# EAGLE design CoCoFlash_v1.04c (EAGLE 7.7.0)

## Sheet 1 of 5
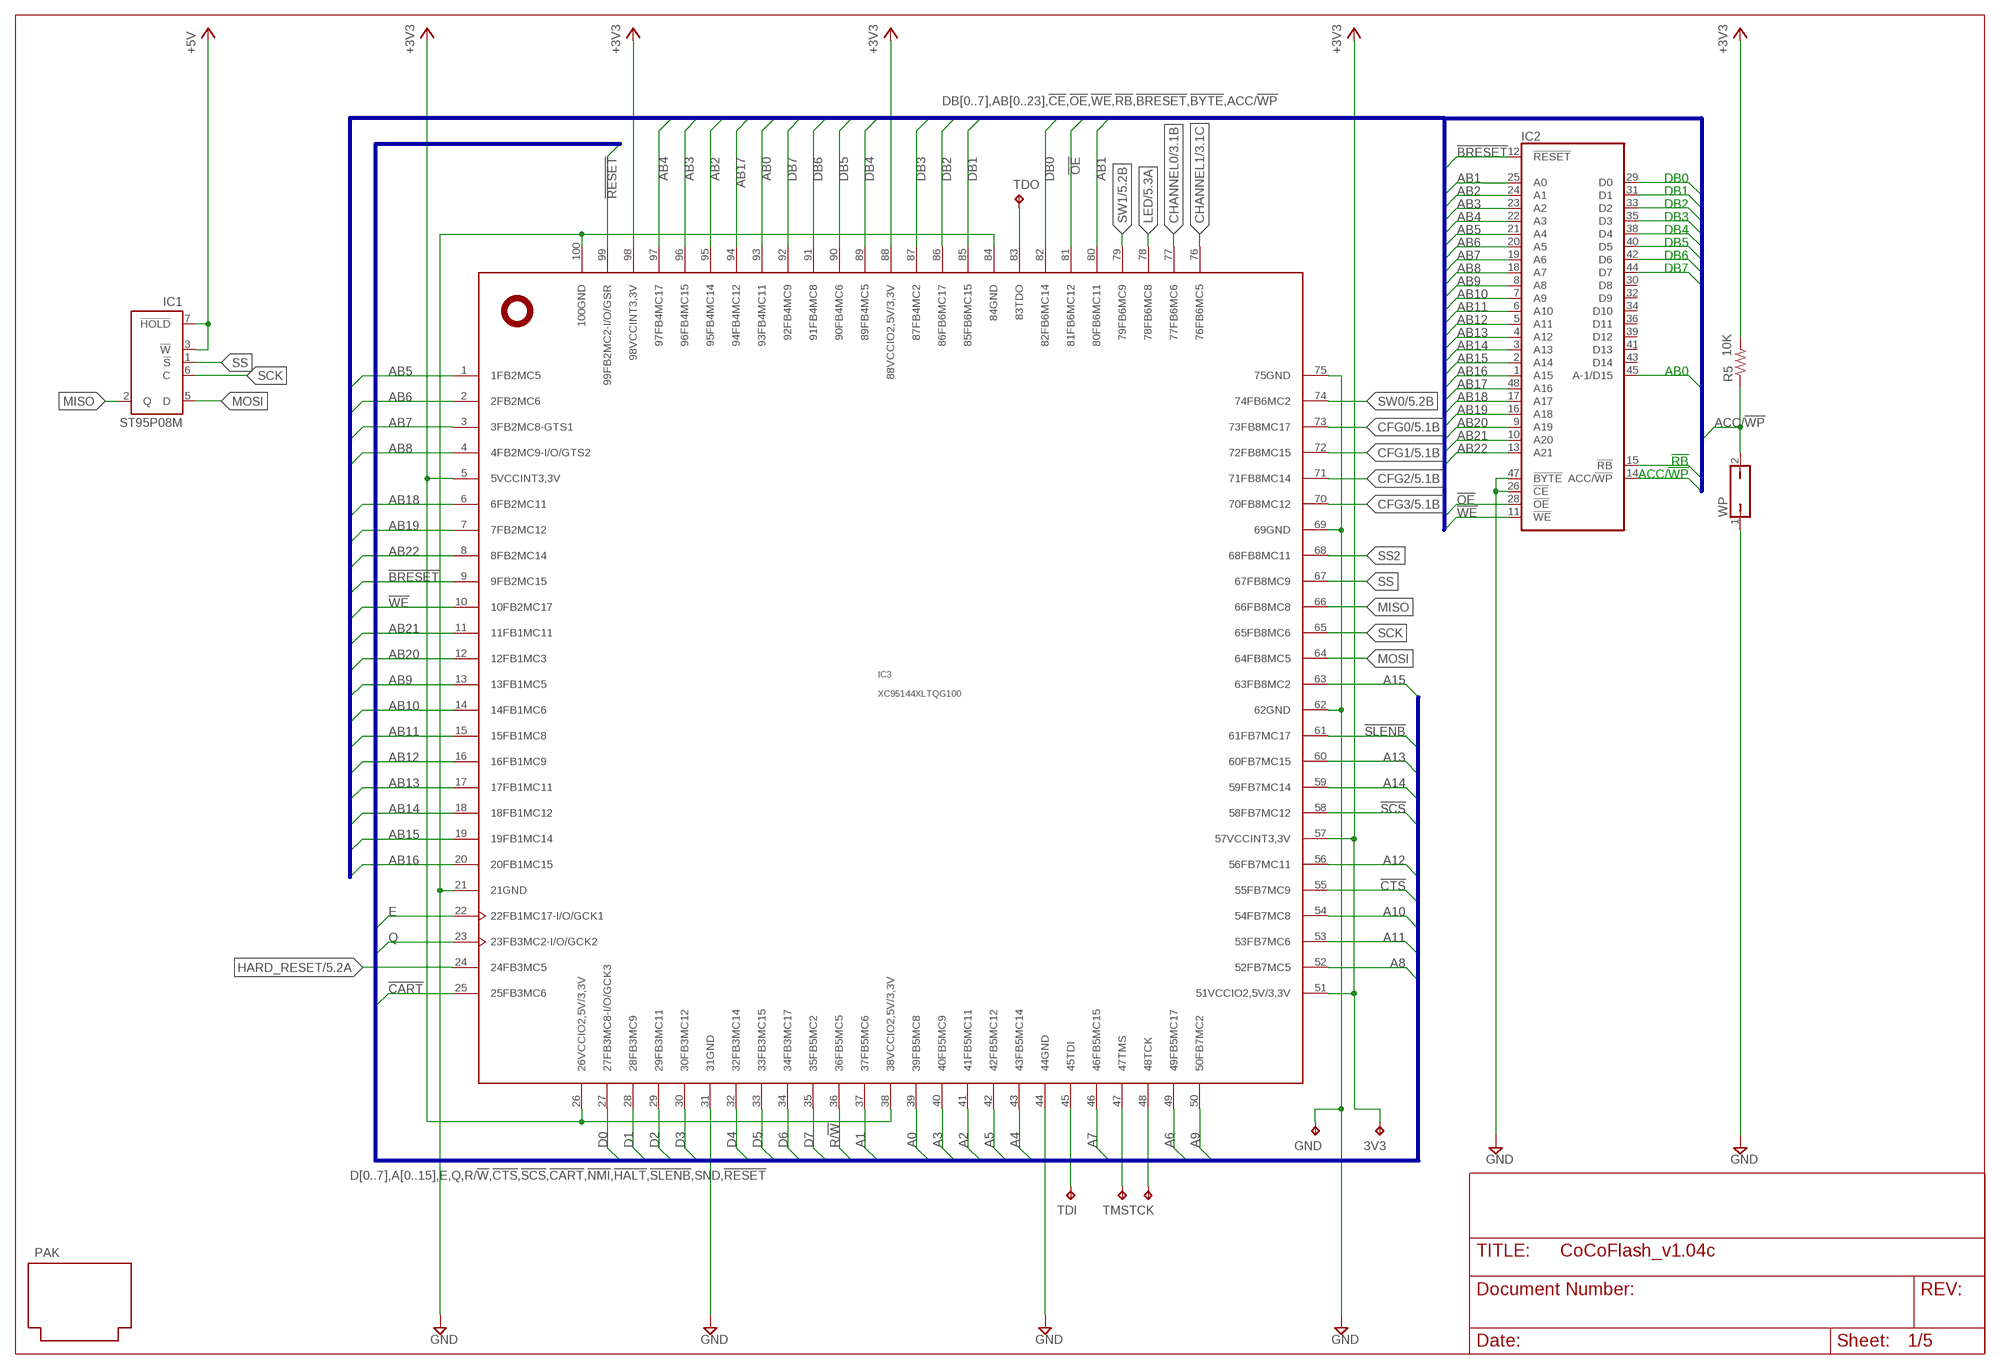
[diagram p0: schematic, sheet 1]

### Parts
3V3  TPTP08R  [TP08R]
GND  TPTP08R  [TP08R]
IC1  ST95P08M  [SO08]
IC2  MX29LV640  [TSOP48]
IC3  XC95144XLTQG100  [TQFP100]
PAK  PROGRAM_PAK  [PROGRAM_PAK]
R5  10K  R-US_R0402  [R0402]
TCK  TPTP08R  [TP08R]
TDI  TPTP08R  [TP08R]
TDO  TPTP08R  [TP08R]
TMS  TPTP08R  [TP08R]
WP  JP1Q  [JP1]

### Nets
!BRESET: IC2.12(!RESET) IC3.9(9FB2MC15)
!CART: IC3.25(25FB3MC6) ; also sheet 2
!CTS: IC3.55(55FB7MC9) ; also sheet 2
!OE: IC2.28(!OE) IC3.81(81FB6MC12)
!RB: IC2.15(!RB)
!RESET: IC3.99(99FB2MC2-I/O/GSR) ; also sheet 2,5
!SCS: IC3.58(58FB7MC12) ; also sheet 2
!SLENB: IC3.61(61FB7MC17) ; also sheet 2
!WE: IC2.11(!WE) IC3.10(10FB2MC17)
+3V3: 3V3.TP IC3.5(5VCCINT3,3V) IC3.26(26VCCIO2,5V/3,3V) IC3.38(38VCCIO2,5V/3,3V) IC3.51(51VCCIO2,5V/3,3V) IC3.57(57VCCINT3,3V) IC3.88(88VCCIO2,5V/3,3V) IC3.98(98VCCINT3,3V) R5.2 ; also sheet 4,5
+5V: IC1.3(!W) IC1.7(!HOLD) ; also sheet 2,3,4,5
A0: IC3.39(39FB5MC8) ; also sheet 2
A1: IC3.37(37FB5MC6) ; also sheet 2
A2: IC3.41(41FB5MC11) ; also sheet 2
A3: IC3.40(40FB5MC9) ; also sheet 2
A4: IC3.43(43FB5MC14) ; also sheet 2
A5: IC3.42(42FB5MC12) ; also sheet 2
A6: IC3.49(49FB5MC17) ; also sheet 2
A7: IC3.46(46FB5MC15) ; also sheet 2
A8: IC3.52(52FB7MC5) ; also sheet 2
A9: IC3.50(50FB7MC2) ; also sheet 2
A10: IC3.54(54FB7MC8) ; also sheet 2
A11: IC3.53(53FB7MC6) ; also sheet 2
A12: IC3.56(56FB7MC11) ; also sheet 2
A13: IC3.60(60FB7MC15) ; also sheet 2
A14: IC3.59(59FB7MC14) ; also sheet 2
A15: IC3.63(63FB8MC2) ; also sheet 2
AB0: IC2.45(A-1/D15) IC3.93(93FB4MC11)
AB1: IC2.25(A0) IC3.80(80FB6MC11)
AB2: IC2.24(A1) IC3.95(95FB4MC14)
AB3: IC2.23(A2) IC3.96(96FB4MC15)
AB4: IC2.22(A3) IC3.97(97FB4MC17)
AB5: IC2.21(A4) IC3.1(1FB2MC5)
AB6: IC2.20(A5) IC3.2(2FB2MC6)
AB7: IC2.19(A6) IC3.3(3FB2MC8-GTS1)
AB8: IC2.18(A7) IC3.4(4FB2MC9-I/O/GTS2)
AB9: IC2.8(A8) IC3.13(13FB1MC5)
AB10: IC2.7(A9) IC3.14(14FB1MC6)
AB11: IC2.6(A10) IC3.15(15FB1MC8)
AB12: IC2.5(A11) IC3.16(16FB1MC9)
AB13: IC2.4(A12) IC3.17(17FB1MC11)
AB14: IC2.3(A13) IC3.18(18FB1MC12)
AB15: IC2.2(A14) IC3.19(19FB1MC14)
AB16: IC2.1(A15) IC3.20(20FB1MC15)
AB17: IC2.48(A16) IC3.94(94FB4MC12)
AB18: IC2.17(A17) IC3.6(6FB2MC11)
AB19: IC2.16(A18) IC3.7(7FB2MC12)
AB20: IC2.9(A19) IC3.12(12FB1MC3)
AB21: IC2.10(A20) IC3.11(11FB1MC11)
AB22: IC2.13(A21) IC3.8(8FB2MC14)
ACC/!WP: IC2.14(ACC/!WP) R5.1 WP.2
CFG0: IC3.73(73FB8MC17) ; also sheet 5
CFG1: IC3.72(72FB8MC15) ; also sheet 5
CFG2: IC3.71(71FB8MC14) ; also sheet 5
CFG3: IC3.70(70FB8MC12) ; also sheet 5
CHANNEL0: IC3.77(77FB6MC6) ; also sheet 3
CHANNEL1: IC3.76(76FB6MC5) ; also sheet 3
D0: IC3.27(27FB3MC8-I/O/GCK3) ; also sheet 2,3
D1: IC3.28(28FB3MC9) ; also sheet 2,3
D2: IC3.29(29FB3MC11) ; also sheet 2,3
D3: IC3.30(30FB3MC12) ; also sheet 2,3
D4: IC3.32(32FB3MC14) ; also sheet 2,3
D5: IC3.33(33FB3MC15) ; also sheet 2,3
D6: IC3.34(34FB3MC17) ; also sheet 2,3
D7: IC3.35(35FB5MC2) ; also sheet 2,3
DB0: IC2.29(D0) IC3.82(82FB6MC14)
DB1: IC2.31(D1) IC3.85(85FB6MC15)
DB2: IC2.33(D2) IC3.86(86FB6MC17)
DB3: IC2.35(D3) IC3.87(87FB4MC2)
DB4: IC2.38(D4) IC3.89(89FB4MC5)
DB5: IC2.40(D5) IC3.90(90FB4MC6)
DB6: IC2.42(D6) IC3.91(91FB4MC8)
DB7: IC2.44(D7) IC3.92(92FB4MC9)
E: IC3.22(22FB1MC17-I/O/GCK1) ; also sheet 2
GND: GND.TP IC2.26(!CE) IC2.47(!BYTE) IC3.21(21GND) IC3.31(31GND) IC3.44(44GND) IC3.62(62GND) IC3.69(69GND) IC3.75(75GND) IC3.84(84GND) IC3.100(100GND) WP.1 ; also sheet 2,3,4,5
HARD_RESET: IC3.24(24FB3MC5) ; also sheet 5
LED: IC3.78(78FB6MC8) ; also sheet 5
MISO: IC1.2(Q) IC3.66(66FB8MC8)
MOSI: IC1.5(D) IC3.64(64FB8MC5)
N$5: IC3.45(45TDI) TDI.TP
N$6: IC3.47(47TMS) TMS.TP
N$7: IC3.48(48TCK) TCK.TP
N$8: IC3.83(83TDO) TDO.TP
Q: IC3.23(23FB3MC2-I/O/GCK2) ; also sheet 2
R/!W: IC3.36(36FB5MC5) ; also sheet 2
SCK: IC1.6(C) IC3.65(65FB8MC6)
SS: IC1.1(!S) IC3.67(67FB8MC9)
SS2: IC3.68(68FB8MC11)
SW0: IC3.74(74FB6MC2) ; also sheet 5
SW1: IC3.79(79FB6MC9) ; also sheet 5
Unconnected: IC2.30(D8) IC2.32(D9) IC2.34(D10) IC2.36(D11) IC2.39(D12) IC2.41(D13) IC2.43(D14)

### Buses
D[0..7],A[0..15],E,Q,R/!W,!CTS,!SCS,!CART,!NMI,!HALT,!SLENB,SND,!RESET
DB[0..7],AB[0..23],!CE,!OE,!WE,!RB,!BRESET,!BYTE,ACC/!WP

## Sheet 2 of 5
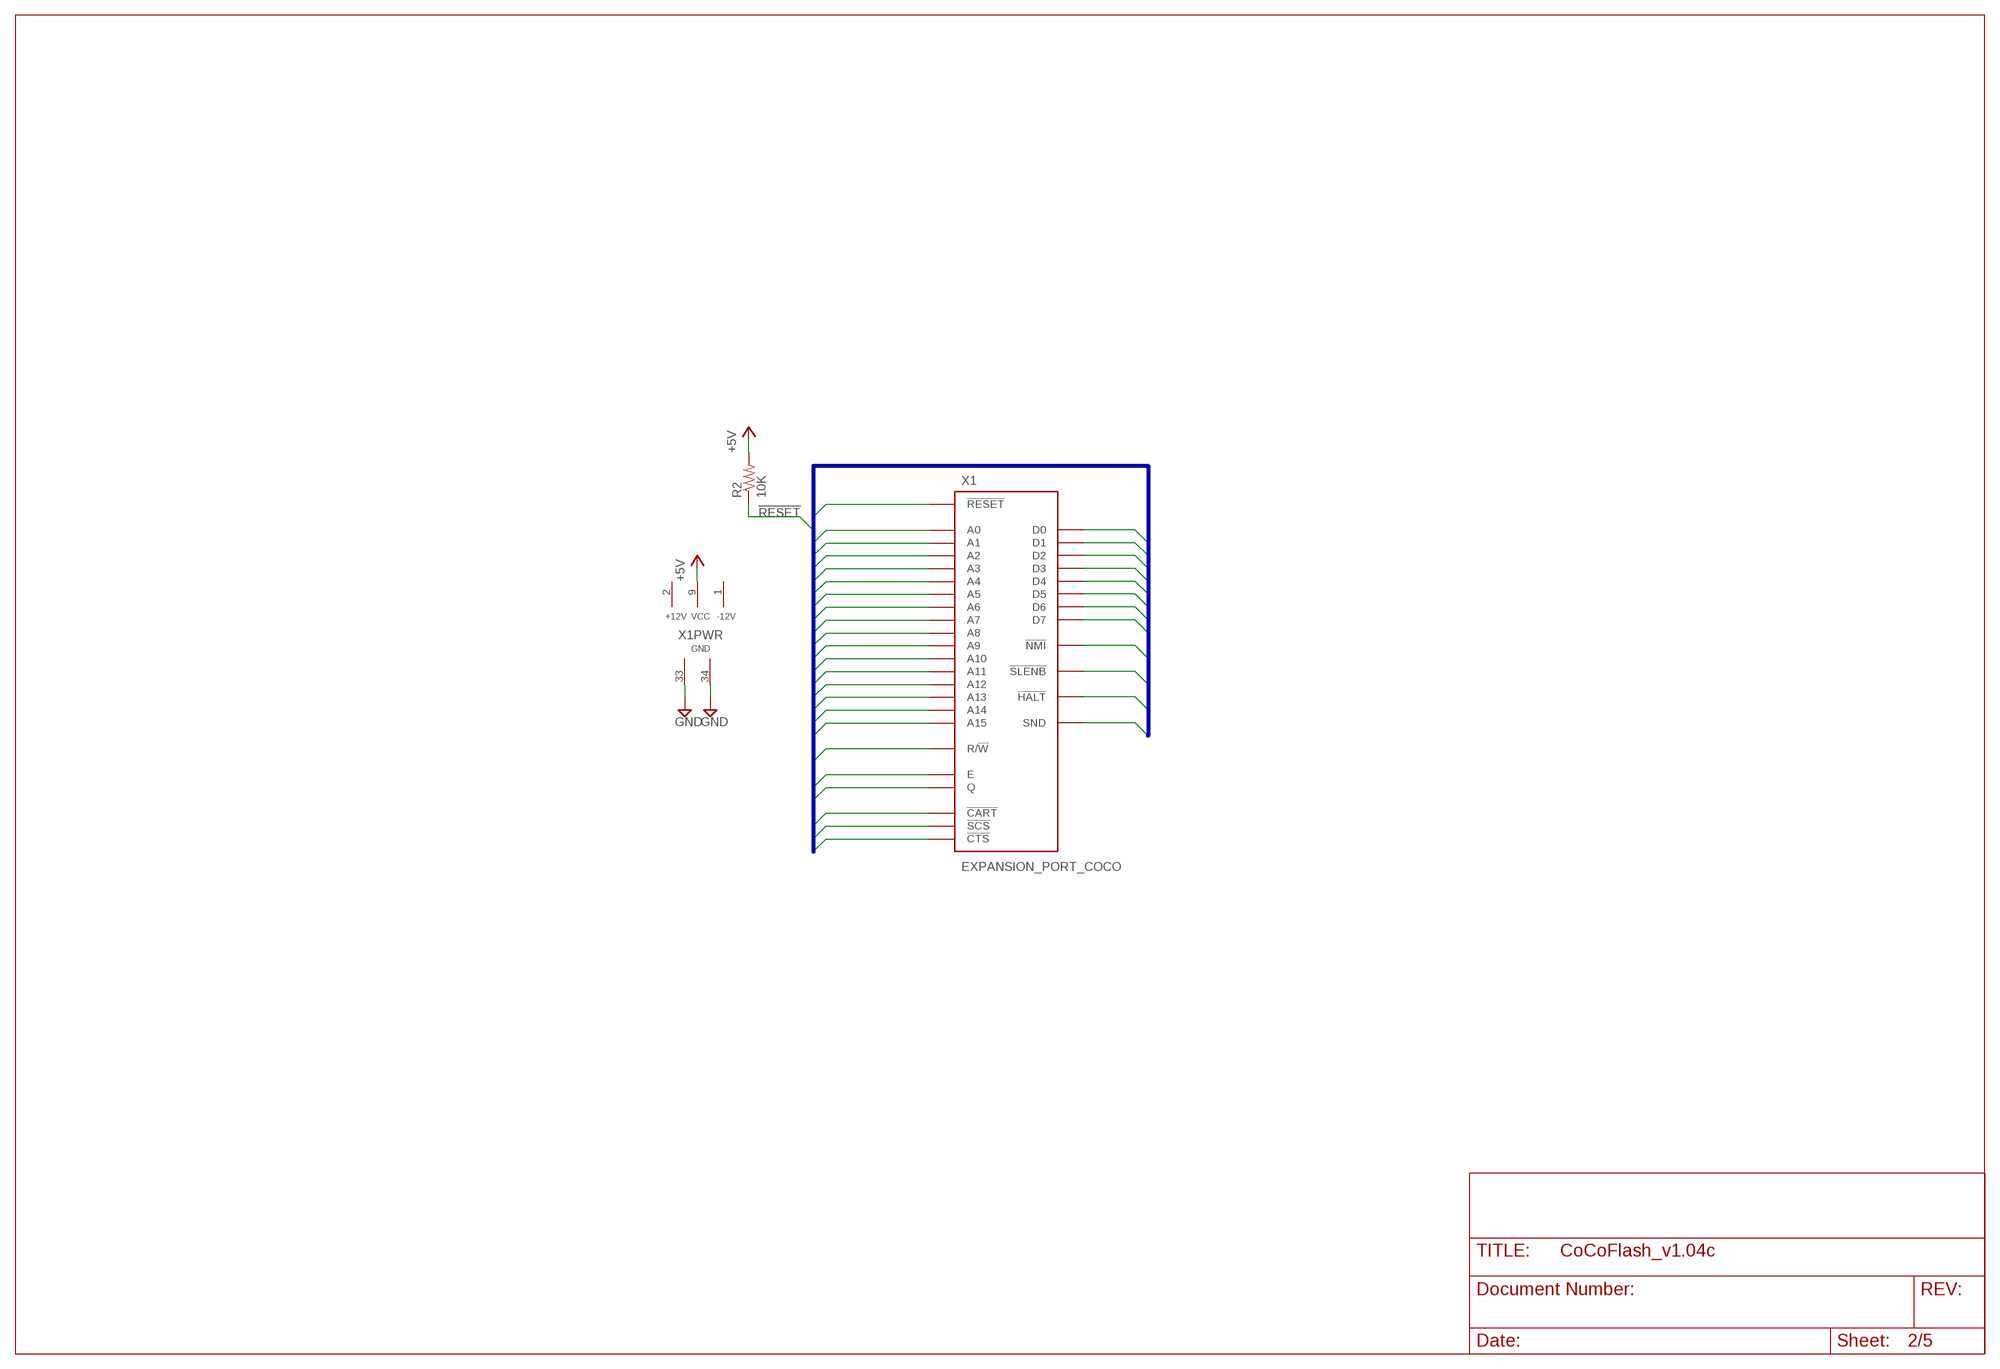
[diagram p1: schematic, sheet 2]

### Parts
R2  10K  R-US_R0402  [R0402]
X1  EXPANSION_PORT_COCO  [MA20-2]

### Nets
!CART: X1.8(!CART) ; also sheet 1
!CTS: X1.32(!CTS) ; also sheet 1
!HALT: X1.3(!HALT)
!NMI: X1.4(!NMI)
!RESET: R2.1 X1.5(!RESET) ; also sheet 1,5
!SCS: X1.36(!SCS) ; also sheet 1
!SLENB: X1.40(!SLENB) ; also sheet 1
+5V: R2.2 X1.9(VCC) ; also sheet 1,3,4,5
A0: X1.19(A0) ; also sheet 1
A1: X1.20(A1) ; also sheet 1
A2: X1.21(A2) ; also sheet 1
A3: X1.22(A3) ; also sheet 1
A4: X1.23(A4) ; also sheet 1
A5: X1.24(A5) ; also sheet 1
A6: X1.25(A6) ; also sheet 1
A7: X1.26(A7) ; also sheet 1
A8: X1.27(A8) ; also sheet 1
A9: X1.28(A9) ; also sheet 1
A10: X1.29(A10) ; also sheet 1
A11: X1.30(A11) ; also sheet 1
A12: X1.31(A12) ; also sheet 1
A13: X1.37(A13) ; also sheet 1
A14: X1.38(A14) ; also sheet 1
A15: X1.39(A15) ; also sheet 1
D0: X1.10(D0) ; also sheet 1,3
D1: X1.11(D1) ; also sheet 1,3
D2: X1.12(D2) ; also sheet 1,3
D3: X1.13(D3) ; also sheet 1,3
D4: X1.14(D4) ; also sheet 1,3
D5: X1.15(D5) ; also sheet 1,3
D6: X1.16(D6) ; also sheet 1,3
D7: X1.17(D7) ; also sheet 1,3
E: X1.6(E) ; also sheet 1
GND: X1.33(GND) X1.34(GND) ; also sheet 1,3,4,5
Q: X1.7(Q) ; also sheet 1
R/!W: X1.18(R/!W) ; also sheet 1
SND: X1.35(SND) ; also sheet 3

### Buses
D[0..7],A[0..15],E,Q,R/!W,!CTS,!SCS,!CART,!NMI,!HALT,!SLENB,SND,!RESET

## Sheet 3 of 5
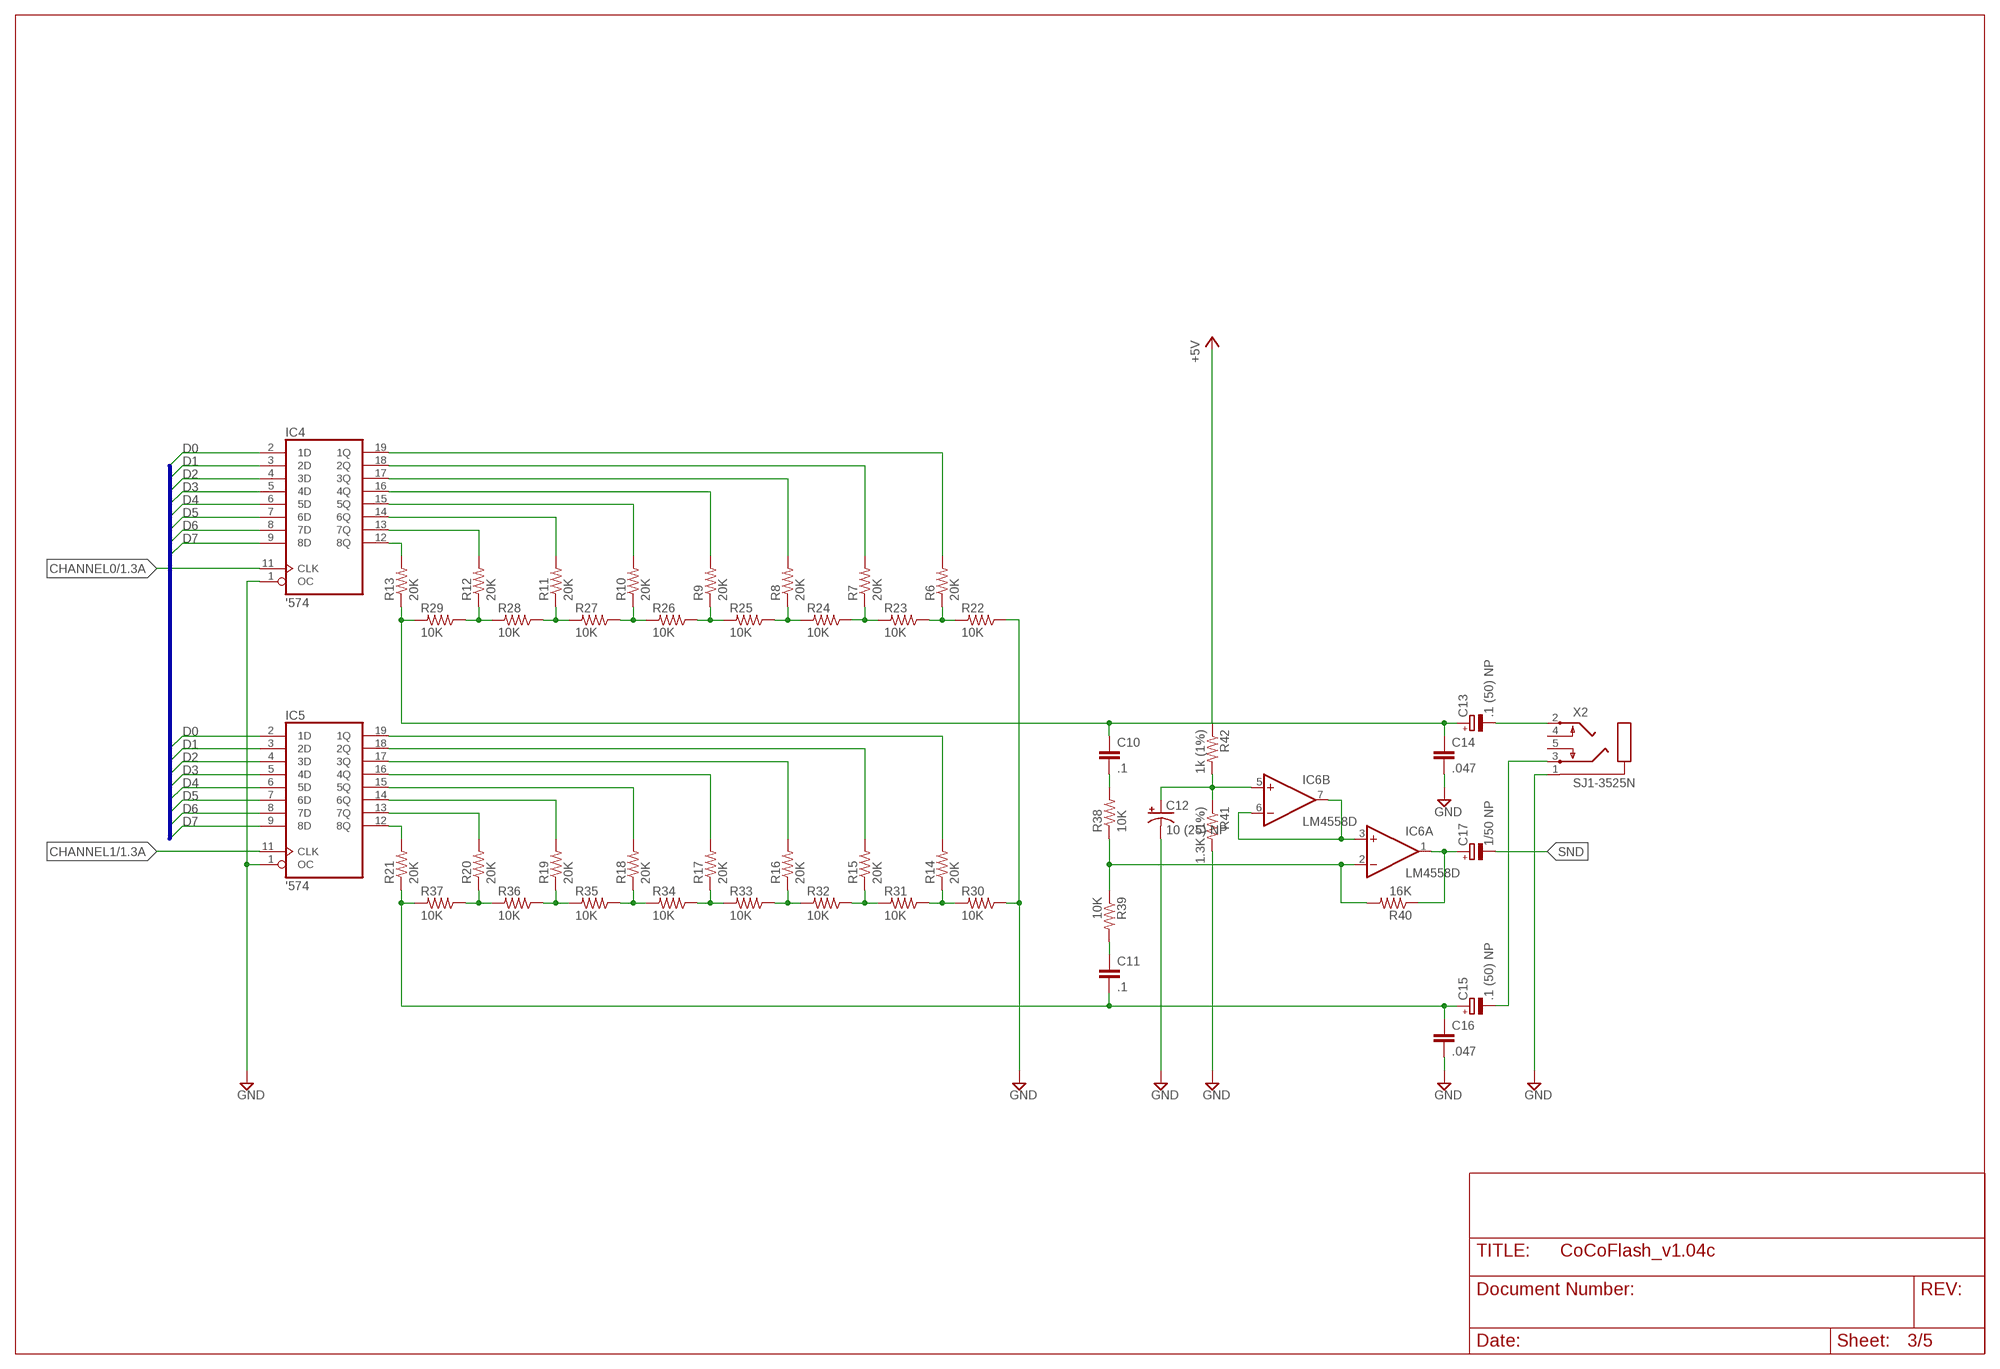
[diagram p2: schematic, sheet 3]

### Parts
C10  .1  C-EU050-025X075  [C050-025X075]
C11  .1  C-EU050-025X075  [C050-025X075]
C12  10 (25) NP  CPOL-USE1.8-4  [E1,8-4]
C13  .1 (50) NP  CPOL-EUE1.8-4  [E1,8-4]
C14  .047  C-EU050-025X075  [C050-025X075]
C15  .1 (50) NP  CPOL-EUE1.8-4  [E1,8-4]
C16  .047  C-EU050-025X075  [C050-025X075]
C17  1/50 NP  CPOL-EUE1.8-4  [E1,8-4]
IC4  '574  74HCT574TWR  [TSSOP20]
IC5  '574  74HCT574TWR  [TSSOP20]
IC6  LM4558D  [SO08]
R6  20K  R-US_R1206  [R1206]
R7  20K  R-US_R1206  [R1206]
R8  20K  R-US_R1206  [R1206]
R9  20K  R-US_R1206  [R1206]
R10  20K  R-US_R1206  [R1206]
R11  20K  R-US_R1206  [R1206]
R12  20K  R-US_R1206  [R1206]
R13  20K  R-US_R1206  [R1206]
R14  20K  R-US_R1206  [R1206]
R15  20K  R-US_R1206  [R1206]
R16  20K  R-US_R1206  [R1206]
R17  20K  R-US_R1206  [R1206]
R18  20K  R-US_R1206  [R1206]
R19  20K  R-US_R1206  [R1206]
R20  20K  R-US_R1206  [R1206]
R21  20K  R-US_R1206  [R1206]
R22  10K  R-US_R1206  [R1206]
R23  10K  R-US_R1206  [R1206]
R24  10K  R-US_R1206  [R1206]
R25  10K  R-US_R1206  [R1206]
R26  10K  R-US_R1206  [R1206]
R27  10K  R-US_R1206  [R1206]
R28  10K  R-US_R1206  [R1206]
R29  10K  R-US_R1206  [R1206]
R30  10K  R-US_R1206  [R1206]
R31  10K  R-US_R1206  [R1206]
R32  10K  R-US_R1206  [R1206]
R33  10K  R-US_R1206  [R1206]
R34  10K  R-US_R1206  [R1206]
R35  10K  R-US_R1206  [R1206]
R36  10K  R-US_R1206  [R1206]
R37  10K  R-US_R1206  [R1206]
R38  10K  R-US_R1206  [R1206]
R39  10K  R-US_R1206  [R1206]
R40  16K  R-US_R1206  [R1206]
R41  1.3K (1%)  R-US_R0402  [R0402]
R42  1k (1%)  R-US_R0402  [R0402]
X2  SJ1-3525N  [SJ1-3525N]

### Nets
+5V: R42.1 ; also sheet 1,2,4,5
CHANNEL0: IC4.11(CLK) ; also sheet 1
CHANNEL1: IC5.11(CLK) ; also sheet 1
D0: IC4.2(1D) IC5.2(1D) ; also sheet 1,2
D1: IC4.3(2D) IC5.3(2D) ; also sheet 1,2
D2: IC4.4(3D) IC5.4(3D) ; also sheet 1,2
D3: IC4.5(4D) IC5.5(4D) ; also sheet 1,2
D4: IC4.6(5D) IC5.6(5D) ; also sheet 1,2
D5: IC4.7(6D) IC5.7(6D) ; also sheet 1,2
D6: IC4.8(7D) IC5.8(7D) ; also sheet 1,2
D7: IC4.9(8D) IC5.9(8D) ; also sheet 1,2
GND: C12.- C14.2 C16.2 IC4.1(OC) IC5.1(OC) R22.1 R30.1 R41.2 X2.1 ; also sheet 1,2,4,5
N$2: IC4.18(2Q) R7.2
N$3: R6.1 R22.2 R23.1
N$4: C15.- X2.3
N$10: IC4.19(1Q) R6.2
N$11: C13.- X2.2
N$12: IC4.17(3Q) R8.2
N$13: IC4.16(4Q) R9.2
N$14: IC4.15(5Q) R10.2
N$15: IC4.14(6Q) R11.2
N$16: IC4.13(7Q) R12.2
N$17: IC4.12(8Q) R13.2
N$18: R7.1 R23.2 R24.1
N$19: R8.1 R24.2 R25.1
N$20: R9.1 R25.2 R26.1
N$21: R10.1 R26.2 R27.1
N$22: R11.1 R27.2 R28.1
N$23: R12.1 R28.2 R29.1
N$24: C10.1 C13.+ C14.1 R13.1 R29.2
N$31: IC5.19(1Q) R14.2
N$32: IC5.18(2Q) R15.2
N$33: IC5.17(3Q) R16.2
N$34: IC5.16(4Q) R17.2
N$35: IC5.15(5Q) R18.2
N$36: IC5.14(6Q) R19.2
N$37: IC5.13(7Q) R20.2
N$38: IC5.12(8Q) R21.2
N$39: C11.2 C15.+ C16.1 R21.1 R37.2
N$40: R20.1 R36.2 R37.1
N$41: R19.1 R35.2 R36.1
N$42: R18.1 R34.2 R35.1
N$43: R17.1 R33.2 R34.1
N$44: R16.1 R32.2 R33.1
N$45: R15.1 R31.2 R32.1
N$46: R14.1 R30.2 R31.1
N$49: C10.2 R38.2
N$50: C11.1 R39.2
N$51: IC6.2(A:-IN) R38.1 R39.1 R40.2
N$52: IC6.3(A:+IN) IC6.6(B:-IN) IC6.7(B:OUT)
N$54: C17.+ IC6.1(A:OUT) R40.1
N$55: C12.+ IC6.5(B:+IN) R41.1 R42.2
SND: C17.- ; also sheet 2
Unconnected: X2.4 X2.5

### Buses
D[0..7],A[0..15],E,Q,R/!W,!CTS,!SCS,!CART,!NMI,!HALT,!SLENB,SND,!RESET

## Sheet 4 of 5
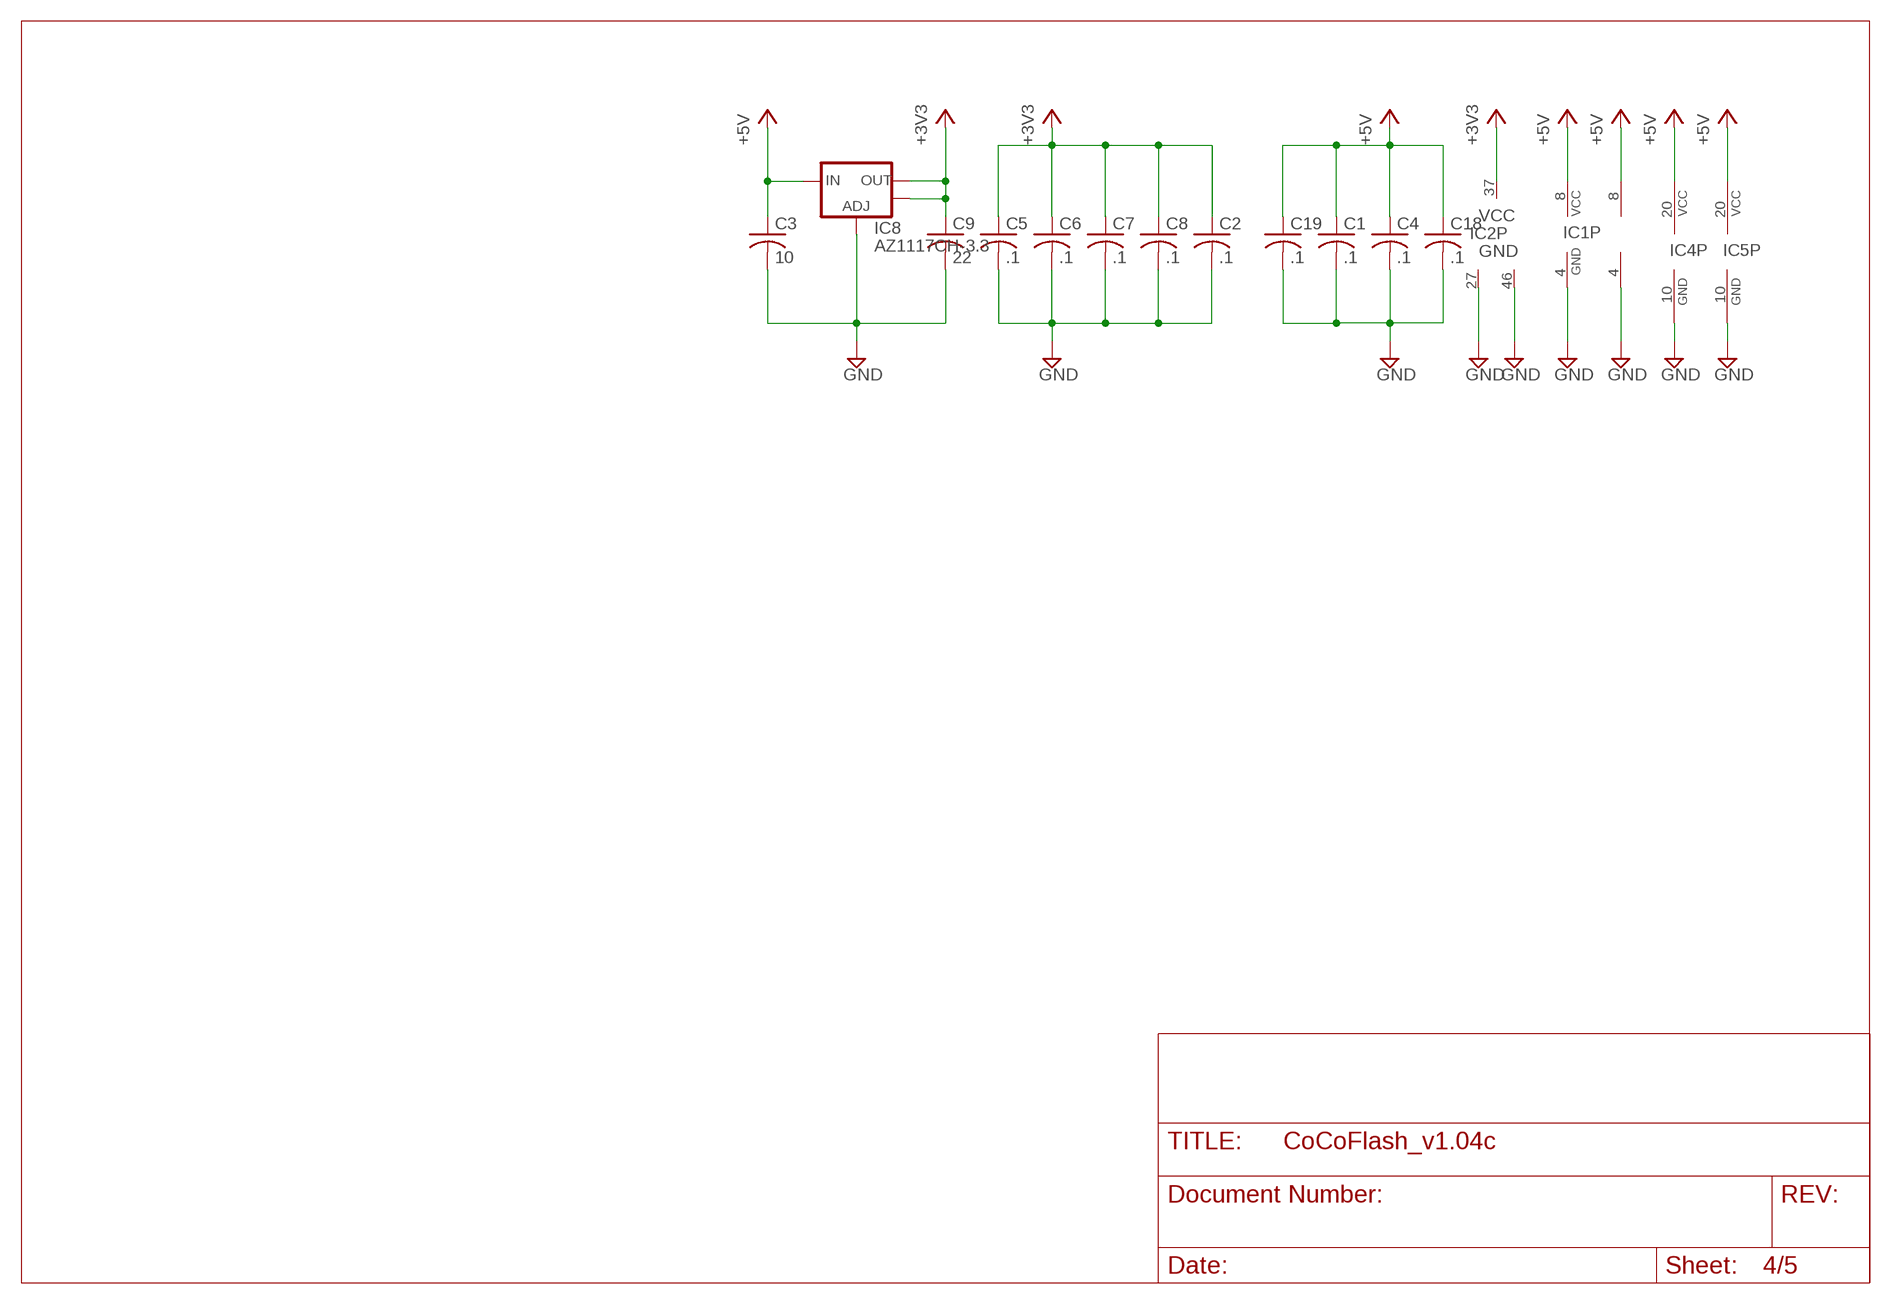
[diagram p3: schematic, sheet 4]

### Parts
C1  .1  C-USC0402  [C0402]
C2  .1  C-USC0402  [C0402]
C3  10  C-USC0805  [C0805]
C4  .1  C-USC0402  [C0402]
C5  .1  C-USC0402  [C0402]
C6  .1  C-USC0402  [C0402]
C7  .1  C-USC0402  [C0402]
C8  .1  C-USC0402  [C0402]
C9  22  C-USC0805  [C0805]
C18  .1  C-USC0402  [C0402]
C19  .1  C-USC0402  [C0402]
IC8  AZ1117CH-3.3  V_REG_LM1117SOT223  [SOT223]

### Nets
+3V3: C2.1 C5.1 C6.1 C7.1 C8.1 C9.1 IC2.37(VCC) IC8.2(OUT) IC8.4(OUT) ; also sheet 1,5
+5V: C1.1 C3.1 C4.1 C18.1 C19.1 IC1.8(VCC) IC4.20(VCC) IC5.20(VCC) IC6.8(P:V+) IC8.3(IN) ; also sheet 1,2,3,5
GND: C1.2 C2.2 C3.2 C4.2 C5.2 C6.2 C7.2 C8.2 C9.2 C18.2 C19.2 IC1.4(GND) IC2.27(GND) IC2.46(GND) IC4.10(GND) IC5.10(GND) IC6.4(P:V-) IC8.1(ADJ) ; also sheet 1,2,3,5

## Sheet 5 of 5
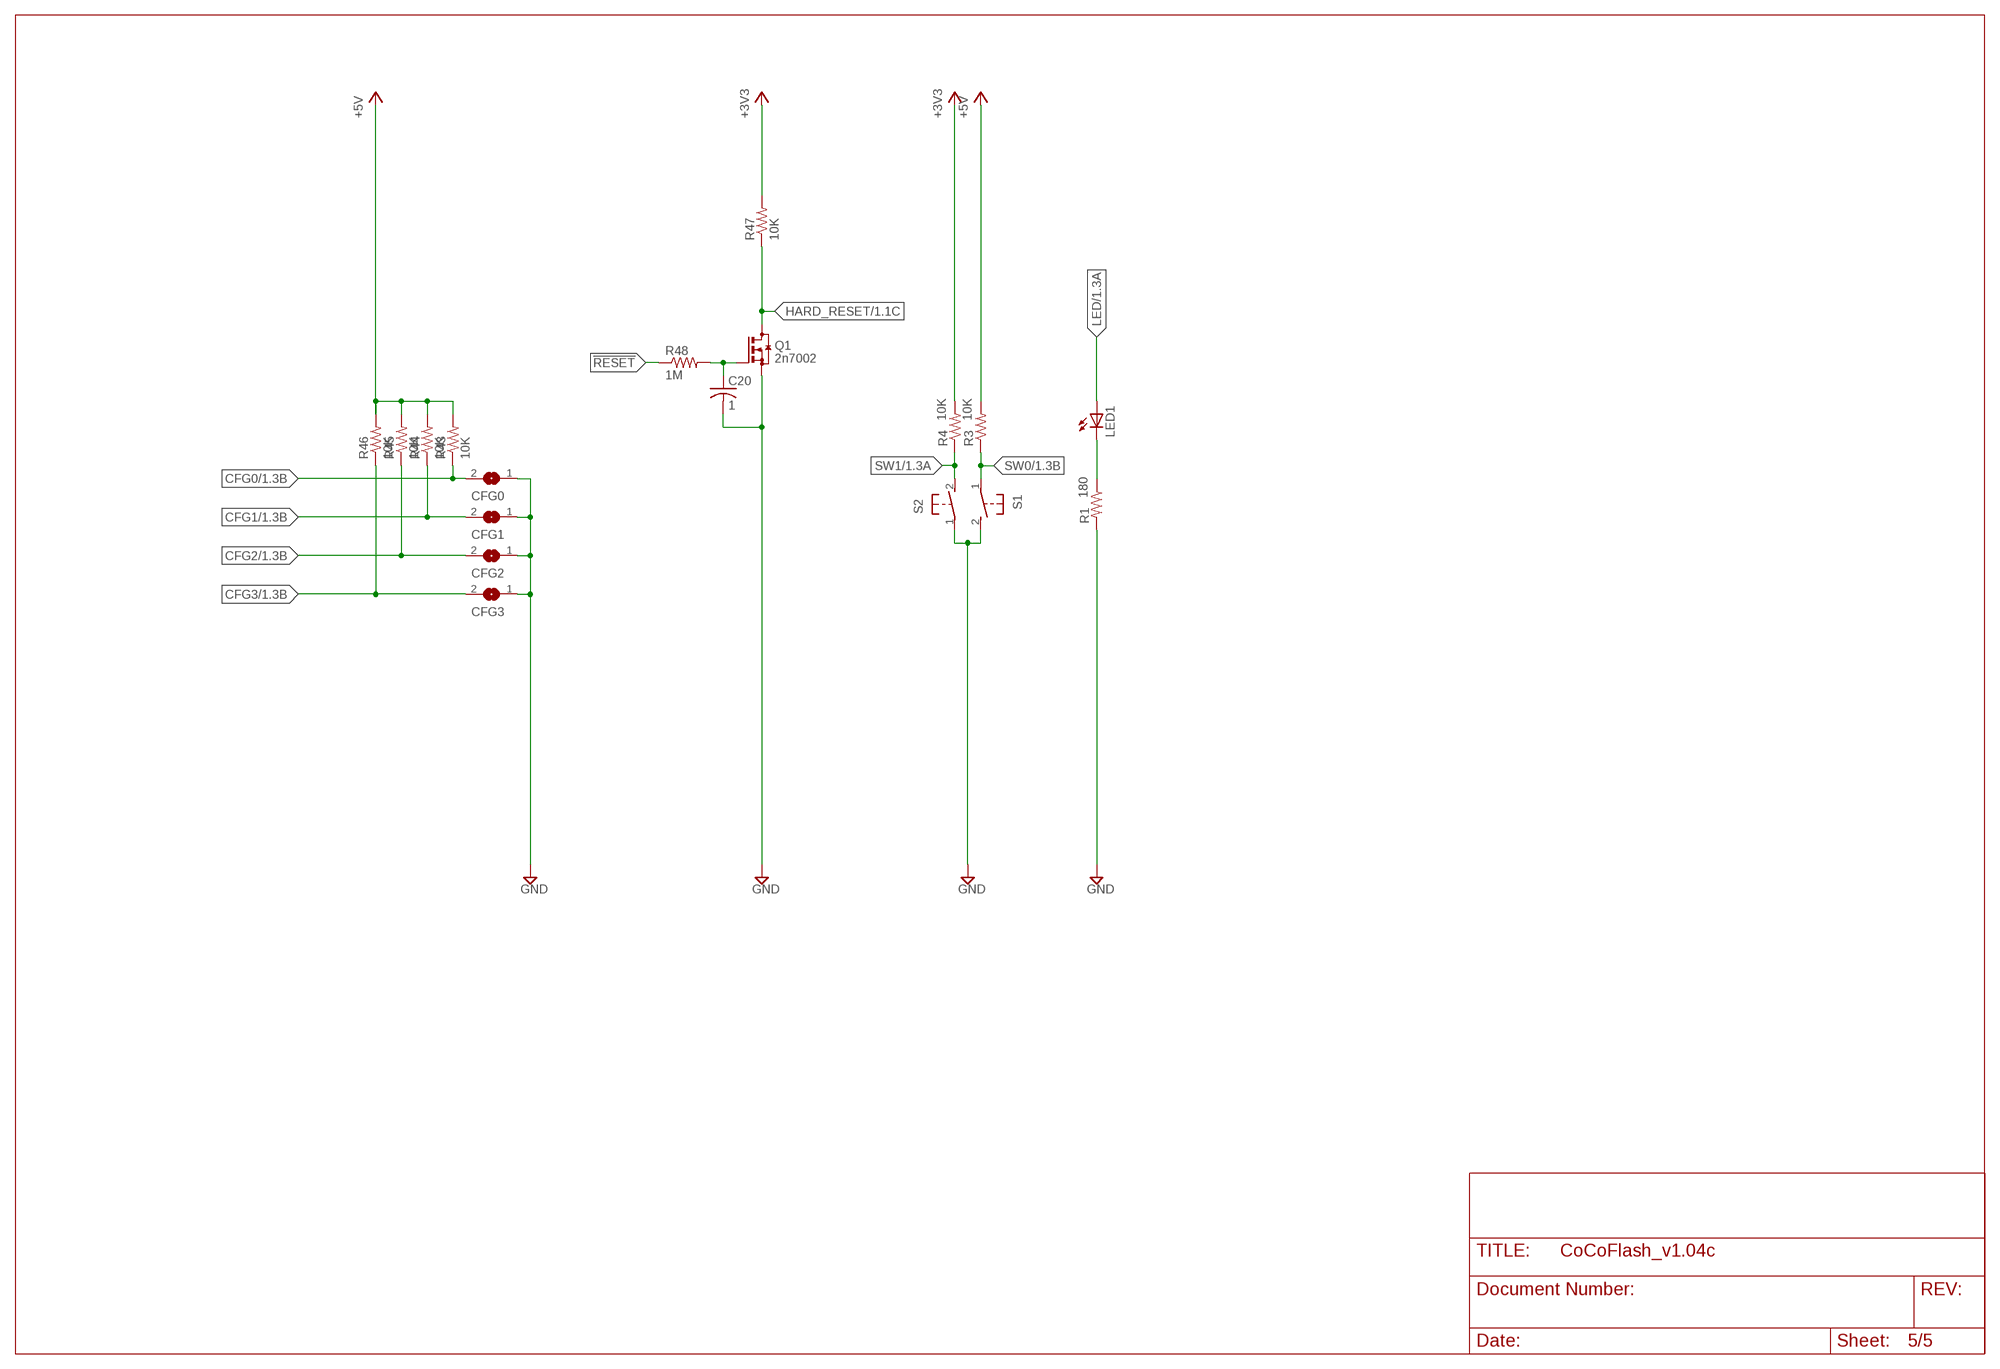
[diagram p4: schematic, sheet 5]

### Parts
C20  1  C-USC0402  [C0402]
CFG0  SJ  [SJ]
CFG1  SJ  [SJ]
CFG2  SJ  [SJ]
CFG3  SJ  [SJ]
LED1  LED3MM  [LED3MM]
Q1  2n7002  BSS123  [SOT23]
R1  180  R-US_R0402  [R0402]
R3  10K  R-US_R0402  [R0402]
R4  10K  R-US_R0402  [R0402]
R43  10K  R-US_R0402  [R0402]
R44  10K  R-US_R0402  [R0402]
R45  10K  R-US_R0402  [R0402]
R46  10K  R-US_R0402  [R0402]
R47  10K  R-US_R0402  [R0402]
R48  1M  R-US_R0402  [R0402]
S1  31-XX  [B3F-31XX]
S2  31-XX  [B3F-31XX]

### Nets
!RESET: R48.1 ; also sheet 1,2
+3V1: C20.1 Q1.1(G) R48.2
+3V3: R4.2 R47.2 ; also sheet 1,4
+5V: R3.2 R43.2 R44.2 R45.2 R46.2 ; also sheet 1,2,3,4
CFG0: CFG0.2 R43.1 ; also sheet 1
CFG1: CFG1.2 R44.1 ; also sheet 1
CFG2: CFG2.2 R45.1 ; also sheet 1
CFG3: CFG3.2 R46.1 ; also sheet 1
GND: C20.2 CFG0.1 CFG1.1 CFG2.1 CFG3.1 Q1.2(S) R1.2 S1.2(S) S2.1(P) ; also sheet 1,2,3,4
HARD_RESET: Q1.3(D) R47.1 ; also sheet 1
LED: LED1.A ; also sheet 1
N$1: LED1.K(C) R1.1
SW0: R3.1 S1.1(P) ; also sheet 1
SW1: R4.1 S2.2(S) ; also sheet 1

## Power pins joined to a net without a drawn wire
+12V: X1.2(+12V)
-12V: X1.1(-12V)

## Library data of the parts
3V3 GND TCK TDI TDO TMS = testpad:TP: Test pad
C1-C9 C18-C20 = rcl:C-US: CAPACITOR, American symbol
C10 C11 C14 C16 = resistor:C-EU: CAPACITOR, European symbol
C12 = rcl:CPOL-US: POLARIZED CAPACITOR, American symbol
C13 C15 C17 = rcl:CPOL-EU: POLARIZED CAPACITOR, European symbol
CFG0 CFG1-CFG3 = jumper:SJ: SMD solder JUMPER
IC1 = st-microelectronics:ST95P08M: Serial EEPROM SPI bus, 1 K x 8; OC_FARNELL: unknown; OC_NEWARK: unknown
IC2 = memory-macronix:MX29LV640
IC3 = xilinx_xc95XXXxl:XC95144XLTQG100
IC4 IC5 = 74xx-us-tsop:74*574: 8-bit D type FLIP FLOP bus driver
IC6 = op-amps-jlb:*4558: *4558 Op Amp Infamous for its use in tube screamers. This op amp has many manufacturers, hence the leading "*" in the name. The JRC4558 is a widely used example.
IC8 = SparkFun:V_REG_LM1117: Voltage Regulator LM1117 Standard adjustable voltage regulator but in SMD form. Spark Fun Electronics SKU : COM-00595
LED1 = led:LED: LED OSRAM: - CHIPLED LG R971, LG N971, LY N971, LG Q971, LY Q971, LO R971, LY R971 LH N974, LH R974 LS Q976, LO Q976, LY Q976 LO Q996 - Hyper CHIPLED LW Q18S LB Q993, LB Q99A, LB R99A - SideLED LS A670, LO A670, LY A670, LG A670, LP A670 LB A673, LV A673, LT A673, LW A673 LH A674 LY A675 LS A676, LA A676, LO A676, LY A676, LW A676 LS A679, LY A679, LG A679 - Hyper Micro SIDELED® LS Y876, LA Y876, LO Y876, LY Y876 LT Y87S - SmartLED LW L88C, LW L88S LB L89C, LB L89S, LG L890 LS L89K, LO L89K, LY L89K LS L896, LA L896, LO L896, LY L896 - TOPLED LS T670, LO T670, LY T670, LG T670, LP T670 LSG T670, LSP T670, LSY T670, LOP T670, LYG T670 LG T671, LOG T671, LSG T671 LB T673, LV T673, LT T673, LW T673 LH T674 LS T676, LA T676, LO T676, LY T676, LB T676, LH T676, LSB T676, LW T676 LB T67C, LV T67C, LT T67C, LS T67K, LO T67K, LY T67K, LW E67C LS E67B, LA E67B, LO E67B, LY E67B, LB E67C, LV E67C, LT E67C LW T67C LS T679, LY T679, LG T679 LS T770, LO T770, LY T770, LG T770, LP T770 LB T773, LV T773, LT T773, LW T773 LH T774 LS E675, LA E675, LY E675, LS T675 LS T776, LA T776, LO T776, LY T776, LB T776 LHGB T686 LT T68C, LB T68C - Hyper Mini TOPLED® LB M676 - Mini TOPLED Santana® LG M470 LS M47K, LO M47K, LY M47K Source: http://www.osram.convergy.de LUXEON: - LUMILED® LXK2-PW12-R00, LXK2-PW12-S00, LXK2-PW14-U00, LXK2-PW14-V00 LXK2-PM12-R00, LXK2-PM12-S00, LXK2-PM14-U00 LXK2-PE12-Q00, LXK2-PE12-R00, LXK2-PE12-S00, LXK2-PE14-T00, LXK2-PE14-U00 LXK2-PB12-K00, LXK2-PB12-L00, LXK2-PB12-M00, LXK2-PB14-N00, LXK2-PB14-P00, LXK2-PB14-Q00 LXK2-PR12-L00, LXK2-PR12-M00, LXK2-PR14-Q00, LXK2-PR14-R00 LXK2-PD12-Q00, LXK2-PD12-R00, LXK2-PD12-S00 LXK2-PH12-R00, LXK2-PH12-S00 LXK2-PL12-P00, LXK2-PL12-Q00, LXK2-PL12-R00 Source: www.luxeon.com KINGBRIGHT: KA-3528ASYC Source: www.kingbright.com
PAK = coco:PROGRAM_PAK
Q1 = transistor-small-signal:BSS123: N-CHANNEL MOS FET
R1 R3-R48 = rcl:R-US_: RESISTOR, American symbol
R2 = resistor:R-US_: RESISTOR, American symbol
S1 S2 = switch-omron:31-XX: OMRON SWITCH; MPN: B3F-3100; OC_FARNELL: 959704; OC_NEWARK: 36M3582
WP = jumper:JP1Q: JUMPER
X1 = coco:EXPANSION_PORT_COCO
X2 = con-cui-jb:SJ1-3525N

## Board
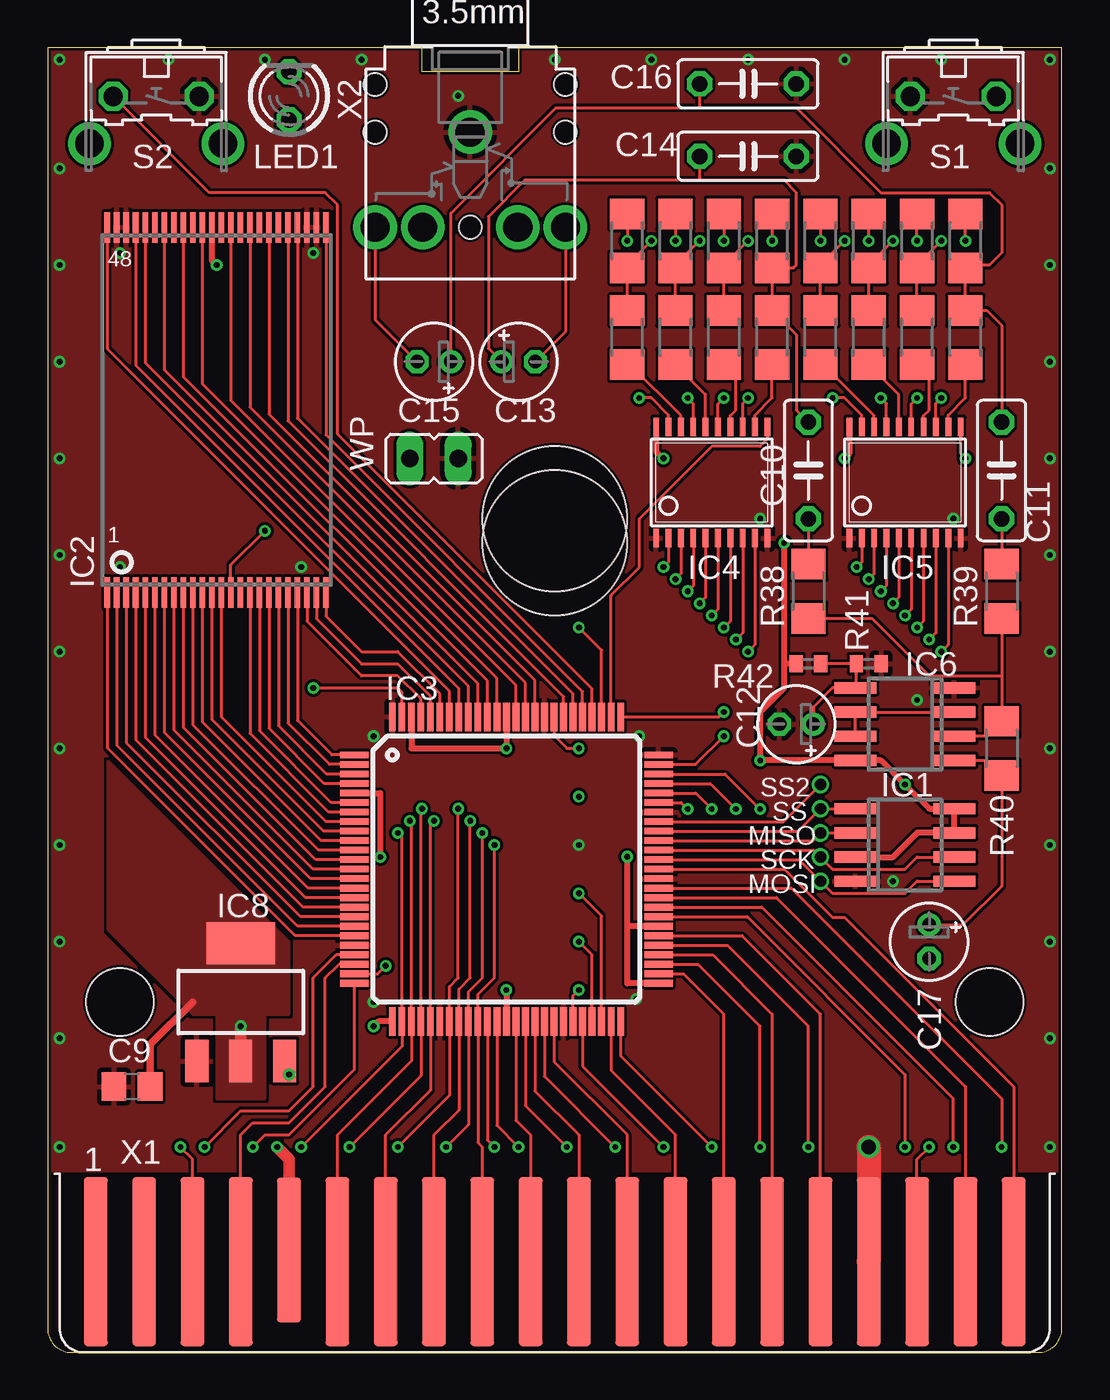
[diagram p5: board, top side]
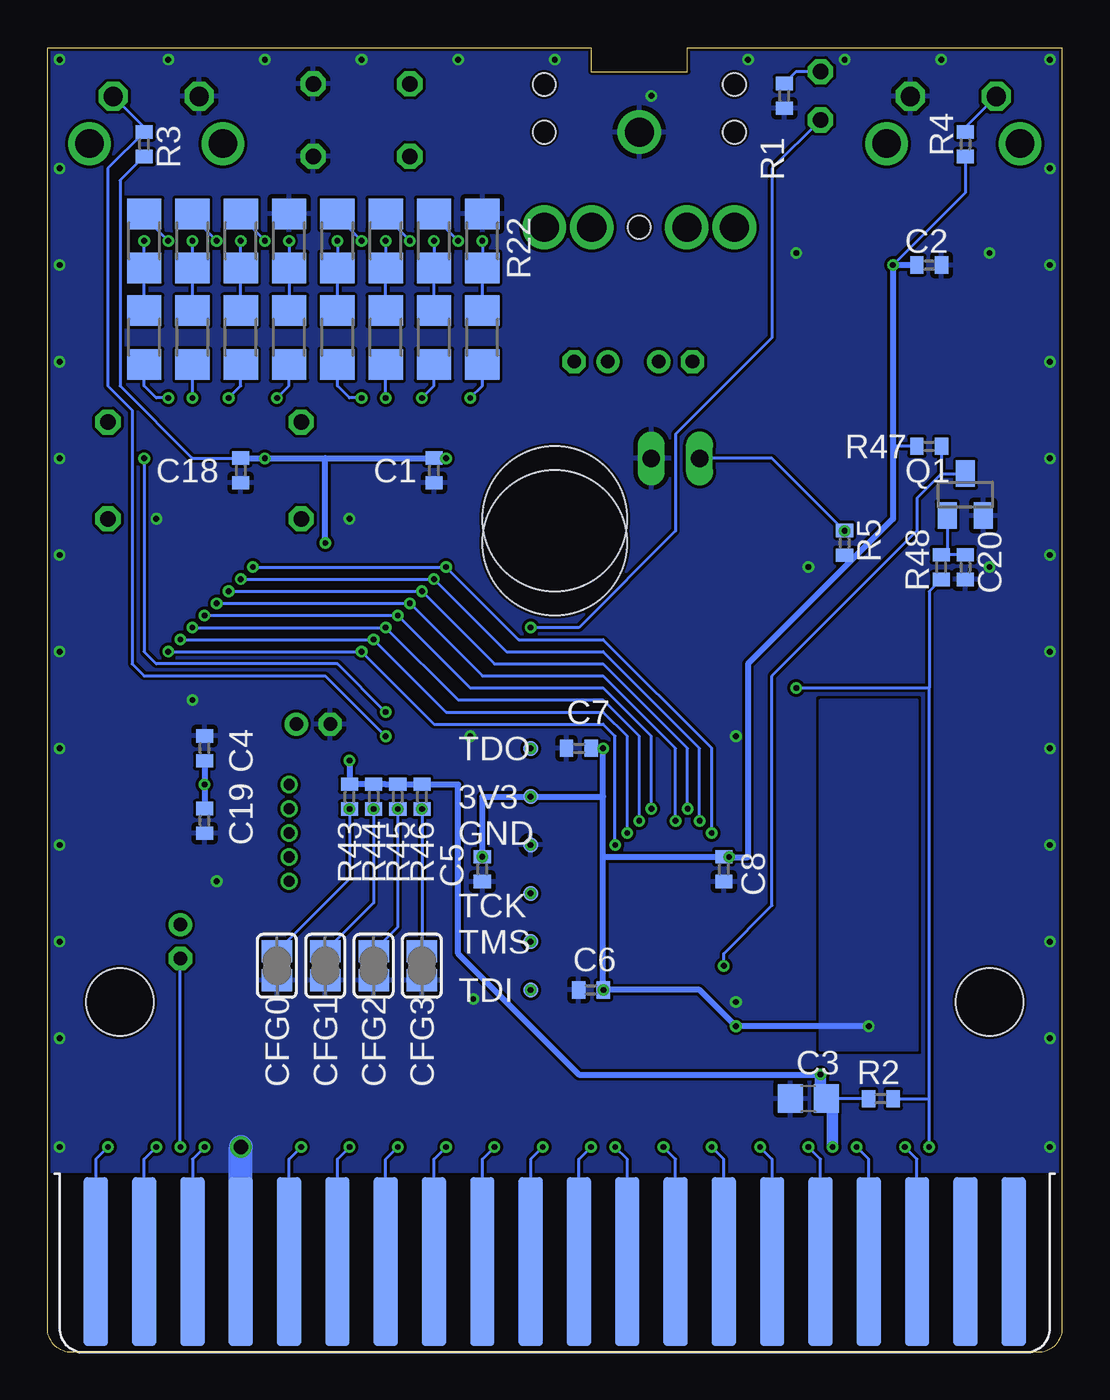
[diagram p6: board, bottom side, seen from below]

Size 53.34 x 68.58 mm. Coordinates in mm from the lower left corner, seen from the top.
Outline: 53.34,68.58 24.77,68.58 24.77,67.31 19.69,67.31 19.69,68.58 0,68.58 0,1.27 arc90 1.27,0 52.07,0 arc90 53.34,1.27 53.34,68.58
Copper layers (1*16): Top 0.035mm / dielectric 1.5mm / Bottom 0.035mm
Design rules "hackvana *": minimum track width 6mil, minimum drill 0.3mm, track to track 6mil, track to pad 6mil, pad to pad 6mil, via to via 6mil, smd to smd 0mil, copper to edge 6mil, drill to drill 6mil, minimum pad ring 10mil, minimum via ring 6mil, stop-mask expansion 2mil, vias tented up to drill 100mil, thermal gap 10mil

### Footprints (pad centres in the part's own frame; a part is rotated, then mirrored left to right if it is on the bottom)
TP08R = smd 0.8 x 0.8: TP 0,0
C0402 = smd 0.7 x 0.9: 1 -0.65,0; 2 0.65,0
C0805 = smd 1.3 x 1.5: 1 -0.95,0; 2 0.95,0
C050-025X075 = drill 0.813 octagon: 1 -2.54,0; 2 2.54,0
E1,8-4 = drill 0.711 pad 1.168: + -0.889,0 | drill 0.711 pad 1.168 octagon: - 0.889,0
SJ = smd 1.168 x 1.6: 1 -0.762,0; 2 0.762,0
SO08 = smd 0.6 x 2.2: 1 -1.905,-2.6; 2 -0.635,-2.6; 3 0.635,-2.6; 4 1.905,-2.6; 5 1.905,2.6; 6 0.635,2.6; 7 -0.635,2.6; 8 -1.905,2.6
TSOP48 = smd 1.6 x 0.3: 1 -9.6,5.75; 2 -9.6,5.25; 3 -9.6,4.75; 4 -9.6,4.25; 5 -9.6,3.75; 6 -9.6,3.25; 7 -9.6,2.75; 8 -9.6,2.25; 9 -9.6,1.75; 10 -9.6,1.25; 11 -9.6,0.75; 12 -9.6,0.25; 13 -9.6,-0.25; 14 -9.6,-0.75; 15 -9.6,-1.25; 16 -9.6,-1.75; 17 -9.6,-2.25; 18 -9.6,-2.75; 19 -9.6,-3.25; 20 -9.6,-3.75; 21 -9.6,-4.25; 22 -9.6,-4.75; 23 -9.6,-5.25; 24 -9.6,-5.75; 25 9.6,-5.75; 26 9.6,-5.25; 27 9.6,-4.75; 28 9.6,-4.25; 29 9.6,-3.75; 30 9.6,-3.25; 31 9.6,-2.75; 32 9.6,-2.25; 33 9.6,-1.75; 34 9.6,-1.25; 35 9.6,-0.75; 36 9.6,-0.25; 37 9.6,0.25; 38 9.6,0.75; 39 9.6,1.25; 40 9.6,1.75; 41 9.6,2.25; 42 9.6,2.75; 43 9.6,3.25; 44 9.6,3.75; 45 9.6,4.25; 46 9.6,4.75; 47 9.6,5.25; 48 9.6,5.75
TQFP100 = smd 1.5 x 0.35: 1 -8,6; 2 -8,5.5; 3 -8,5; 4 -8,4.5; 5 -8,4; 6 -8,3.5; 7 -8,3; 8 -8,2.5; 9 -8,2; 10 -8,1.5; 11 -8,1; 12 -8,0.5; 13 -8,0; 14 -8,-0.5; 15 -8,-1; 16 -8,-1.5; 17 -8,-2; 18 -8,-2.5; 19 -8,-3; 20 -8,-3.5; 21 -8,-4; 22 -8,-4.5; 23 -8,-5; 24 -8,-5.5; 25 -8,-6; 51 8,-6; 52 8,-5.5; 53 8,-5; 54 8,-4.5; 55 8,-4; 56 8,-3.5; 57 8,-3; 58 8,-2.5; 59 8,-2; 60 8,-1.5; 61 8,-1; 62 8,-0.5; 63 8,0; 64 8,0.5; 65 8,1; 66 8,1.5; 67 8,2; 68 8,2.5; 69 8,3; 70 8,3.5; 71 8,4; 72 8,4.5; 73 8,5; 74 8,5.5; 75 8,6 | smd 0.35 x 1.5: 26 -6,-8; 27 -5.5,-8; 28 -5,-8; 29 -4.5,-8; 30 -4,-8; 31 -3.5,-8; 32 -3,-8; 33 -2.5,-8; 34 -2,-8; 35 -1.5,-8; 36 -1,-8; 37 -0.5,-8; 38 0,-8; 39 0.5,-8; 40 1,-8; 41 1.5,-8; 42 2,-8; 43 2.5,-8; 44 3,-8; 45 3.5,-8; 46 4,-8; 47 4.5,-8; 48 5,-8; 49 5.5,-8; 50 6,-8; 76 6,8; 77 5.5,8; 78 5,8; 79 4.5,8; 80 4,8; 81 3.5,8; 82 3,8; 83 2.5,8; 84 2,8; 85 1.5,8; 86 1,8; 87 0.5,8; 88 0,8; 89 -0.5,8; 90 -1,8; 91 -1.5,8; 92 -2,8; 93 -2.5,8; 94 -3,8; 95 -3.5,8; 96 -4,8; 97 -4.5,8; 98 -5,8; 99 -5.5,8; 100 -6,8
TSSOP20 = smd 0.305 x 0.991: 1 -2.925,-2.918; 2 -2.275,-2.918; 3 -1.625,-2.918; 4 -0.975,-2.918; 5 -0.325,-2.918; 6 0.325,-2.918; 7 0.975,-2.918; 8 1.625,-2.918; 9 2.275,-2.918; 10 2.925,-2.918; 11 2.925,2.918; 12 2.275,2.918; 13 1.625,2.918; 14 0.975,2.918; 15 0.325,2.918; 16 -0.325,2.918; 17 -0.975,2.918; 18 -1.625,2.918; 19 -2.275,2.918; 20 -2.925,2.918
SOT223 = smd 1.219 x 2.235: 1 -2.311,-3.099; 2 0,-3.099; 3 2.311,-3.099 | smd 3.6 x 2.2: 4 0,3.099
LED3MM = drill 0.813 octagon: A -1.27,0; K 1.27,0
PROGRAM_PAK = hole 7.62: 0,1.27; 0,0 | hole 3.556: -22.86,-24.13; 22.86,-24.13
SOT23 = smd 1 x 1.4: 1 -0.95,-1.1; 2 0.95,-1.1; 3 0,1.1
R0402 = smd 0.7 x 0.9: 1 -0.65,0; 2 0.65,0
R1206 = smd 1.6 x 1.803: 1 -1.422,0; 2 1.422,0
B3F-31XX = drill 1.016 octagon: 1 -2.261,-1.245; 2 2.261,-1.245 | drill 1.499 pad 2.159: 3 -3.505,1.245; 4 3.505,1.245
JP1 = drill 0.914 long: 1 0,-1.27; 2 0,1.27
MA20-2 = smd 1.27 x 8.89: 1 -24.13,-0.305; 3 -21.59,-0.305; 5 -19.05,-0.305; 7 -16.51,-0.305; 11 -11.43,-0.305; 13 -8.89,-0.305; 15 -6.35,-0.305; 17 -3.81,-0.305; 19 -1.27,-0.305; 21 1.27,-0.305; 23 3.81,-0.305; 25 6.35,-0.305; 27 8.89,-0.305; 29 11.43,-0.305; 31 13.97,-0.305; 33 16.51,-0.305; 35 19.05,-0.305; 37 21.59,-0.305; 39 24.13,-0.305 | smd 1.27 x 8.89 bottom: 2 -24.13,-0.305; 4 -21.59,-0.305; 6 -19.05,-0.305; 8 -16.51,-0.305; 10 -13.97,-0.305; 12 -11.43,-0.305; 14 -8.89,-0.305; 16 -6.35,-0.305; 18 -3.81,-0.305; 20 -1.27,-0.305; 22 1.27,-0.305; 24 3.81,-0.305; 26 6.35,-0.305; 28 8.89,-0.305; 30 11.43,-0.305; 32 13.97,-0.305; 34 16.51,-0.305; 36 19.05,-0.305; 38 21.59,-0.305; 40 24.13,-0.305 | smd 1.27 x 7.62: 9 -13.97,0.305
SJ1-3525N = drill 1.53: 1 0,0; 2 5,5; 3 5,-5; 4 5,2.5; 5 5,-2.5 | hole 1.2: 0,5; -2.5,5; 5,0; 0,-5; -2.5,-5

### Placement (x,y rotation side)
3V3  27.94,29.21 90 bottom
C1  33.02,46.36 270 bottom
C2  6.99,57.15 0 bottom
C3  13.34,13.34 180 bottom
C4  45.09,31.75 90 bottom
C5  30.48,25.4 270 bottom
C6  24.77,19.05 180 bottom
C7  25.4,31.75 180 bottom
C8  17.78,25.4 270 bottom
C9  4.45,13.97 180 top
C10  40.01,46.36 270 top
C11  50.17,46.36 90 top
C12  39.37,33.02 180 top
C13  24.77,52.07 0 top
C14  36.83,62.87 0 top
C15  20.32,52.07 180 top
C16  36.83,66.67 0 top
C17  46.36,21.59 270 top
C18  43.18,46.36 270 bottom
C19  45.09,27.94 270 bottom
C20  5.08,41.27 270 bottom
CFG0  41.28,20.32 90 bottom
CFG1  38.73,20.32 90 bottom
CFG2  36.2,20.32 90 bottom
CFG3  33.66,20.32 90 bottom
GND  27.94,26.67 0 bottom
IC1  45.09,26.67 270 top
IC2  8.89,49.53 90 top
IC3  24.13,25.4 0 top
IC4  34.93,45.72 0 top
IC5  45.09,45.72 0 top
IC6  45.09,33.02 90 top
IC8  10.16,18.42 0 top
LED1  12.7,66.04 90 top
PAK  26.67,42.55 0 top
Q1  5.08,45.09 0 bottom
R1  14.61,66.04 270 bottom
R2  9.53,13.34 180 bottom
R3  48.26,63.5 270 bottom
R4  5.08,63.5 270 bottom
R5  11.43,42.55 270 bottom
R6  30.48,53.34 270 bottom
R7  30.48,53.34 270 top
R8  33.02,53.34 270 bottom
R9  33.02,53.34 270 top
R10  35.56,53.34 270 bottom
R11  35.56,53.34 270 top
R12  38.1,53.34 270 bottom
R13  38.1,53.34 270 top
R14  40.64,53.34 270 bottom
R15  40.64,53.34 270 top
R16  43.18,53.34 270 bottom
R17  43.18,53.34 270 top
R18  45.72,53.34 270 bottom
R19  45.72,53.34 270 top
R20  48.26,53.34 270 bottom
R21  48.26,53.34 270 top
R22  30.48,58.42 270 bottom
R23  30.48,58.42 270 top
R24  33.02,58.42 270 bottom
R25  33.02,58.42 270 top
R26  35.56,58.42 270 bottom
R27  35.56,58.42 270 top
R28  38.1,58.42 270 bottom
R29  38.1,58.42 270 top
R30  40.64,58.42 270 bottom
R31  40.64,58.42 270 top
R32  43.18,58.42 270 bottom
R33  43.18,58.42 270 top
R34  45.72,58.42 270 bottom
R35  45.72,58.42 270 top
R36  48.26,58.42 270 bottom
R37  48.26,58.42 270 top
R38  40.01,40.01 90 top
R39  50.17,40.01 90 top
R40  50.17,31.75 90 top
R41  43.18,36.2 0 top
R42  40.01,36.2 0 top
R43  37.47,29.21 90 bottom
R44  36.2,29.21 90 bottom
R45  34.93,29.21 90 bottom
R46  33.66,29.21 90 bottom
R47  6.99,47.62 180 bottom
R48  6.35,41.27 90 bottom
S1  47.62,64.77 180 top
S2  5.72,64.77 180 top
TCK  27.94,24.13 0 bottom
TDI  27.94,19.05 90 bottom
TDO  27.94,31.75 0 bottom
TMS  27.94,21.59 90 bottom
WP  20.32,46.99 90 top
X1  26.67,5.08 0 top
X2  22.23,64.14 270 top

### Tracks (layer width: path | path; a pad name or v marks a point on that pad's centre or on a via)
!BRESET
  Top 0.152: IC2.12 8.64,33.27 14.51,27.4 IC3.9
!CART  (via drill 0.3)
  Top 0.152: v10.8,10.8 11.43,11.43 12.7,11.43 16.13,14.86 IC3.25
  Bottom 0.152: X1.8 10.16,10.16 v10.8,10.8
!CTS  (via drill 0.3)
  Top 0.152: v40.01,10.8 40.01,17.15 35.75,21.4 IC3.55
  Bottom 0.152: X1.32 40.64,10.16 v40.01,10.8
!OE
  Top 0.152: IC3.81 27.63,34.62 13.14,49.11 | IC2.28 13.14,49.11 | 13.14,49.11 13.14,49.09
!RESET  (via drill 0.3)
  Top 0.152: X1.5 7.62,10.16 v6.99,10.8 | v13.97,34.93 18.41,34.93 18.63,34.71 IC3.99
  Bottom 0.152: v6.99,10.8 6.99,13.34 | 6.99,13.34 6.99,34.93 | R2.1 6.99,13.34 | v13.97,34.93 6.99,34.93 | R48.1 6.97,40.01 6.99,40.01 6.99,34.93
!SCS  (via drill 0.3)
  Top 0.152: v45.09,10.8 45.09,14.61 36.79,22.9 IC3.58
  Bottom 0.152: v45.09,10.8 45.72,10.16 X1.36
!SLENB  (via drill 0.3)
  Top 0.152: v50.17,10.8 50.17,13.34 39.1,24.4 IC3.61
  Bottom 0.152: v50.17,10.8 50.8,10.16 X1.40
!WE
  Top 0.152: IC2.11 8.14,33.14 14.38,26.9 IC3.10
+3V1
  Bottom 0.152: Q1.1 6.03,41.93 | C20.1 6.03,41.93 | 6.03,41.93 R48.2
+3V3  (via drill 0.3)
  Top 0.305: IC3.98 19.13,31.75 v24.13,31.75 IC3.88 | IC3.51 30.48,19.4 30.48,22.4 | IC3.57 30.48,22.4 | 30.48,22.4 C5.1 | IC3.5 17.5,29.4 v17.5,26.04 | IC2.37 8.64,57.4 v8.89,57.15 | 24.12,17.43 24.15,17.4 IC3.38 24.13,19.05 C6.1 | IC3.26 17.4,17.4 v17.15,17.15
  Top 0.406: C9.1 5.4,16.19 7.62,18.42
  Top 0.61: IC8.2 v10.16,17.15
  Bottom 0.152: v8.89,57.15 5.08,60.96 R4.2 | R47.2 8.89,47.62 | R5.2 10.81,41.9 10.48,42.23
  Bottom 0.305: C7.1 v24.13,31.75 24.13,29.21 | C5.1 30.48,29.21 3V3.TP 24.13,29.21 | C2.1 v8.89,57.15 8.89,47.62 8.89,43.82 10.48,42.23 16.51,36.2 16.51,26.04 v17.5,26.04 17.77,26.04 C8.1 24.13,26.04 | 24.13,26.04 24.13,19.05 C6.1 19.05,19.05 v17.15,17.15 v10.16,17.15 | 24.13,26.04 24.13,29.21
  other vias: 27.94,29.21 24.12,19.05 30.48,26.05
  pour Top (no thermals): 3.18,31.12 3.18,22.23 7.62,17.78 8.89,17.78 8.89,13.34 11.43,13.34 11.43,17.78 12.7,17.78 12.7,21.59
  pour Bottom (no thermals): 7.62,34.29 7.62,15.88 12.7,15.88 12.7,34.29
+5V  (via drill 0.3)
  Top 0.152: 47.06,27.32 47.67,27.32 IC1.7
  Top 0.305: IC1.7 IC1.8 46.36,28.58 v45.09,29.85 | 47.06,27.32 45.73,27.32 44.45,26.04 IC1.3 | IC5.20 42.16,47.24 v41.91,46.99 | IC4.20 32,47.38 v32.39,46.99 | 38.73,36.2 38.73,34.93 37.47,33.66 v37.47,31.12 IC6.8 43.81,31.12 v45.09,29.85 | 38.73,36.2 v38.73,42.55 | R42.1 38.73,36.2 | v45.09,29.85 45.07,29.86 v45.07,29.85
  Top 0.61: v12.07,10.8 12.7,10.16 X1.9 | IC8.3 12.7,15.32 v12.7,14.61
  Bottom 0.152: R2.2 C3.1 | C18.1 45.73,47.01 49.53,50.8 49.53,61.59 48.28,62.85 R3.2 | R46.2 34.29,29.85 R45.2 | R44.2 35.56,29.85 | R43.2
  Bottom 0.305: v12.7,14.61 25.4,14.61 31.75,20.96 31.75,29.85 34.29,29.85 35.56,29.85 35.56,29.86 R43.2 v37.47,31.12 | C18.1 41.93,47.01 v41.91,46.99 41.9,47.01 38.73,47.01 | 38.73,47.01 C1.1 33.02,46.99 v32.39,46.99 | v38.73,42.55 38.73,47.01 | 45.07,29.86 v45.09,29.85 | C4.1 v45.09,29.85 | v45.09,29.85 C19.1
  Bottom 0.61: v12.07,10.8 12.07,13.34 C3.1 12.7,13.34 v12.7,14.61
A0
  Top 0.152: X1.19 25.4,11.43 24.63,12.2 IC3.39
A1  (via drill 0.3)
  Top 0.152: v24.77,10.8 23.63,11.93 IC3.37
  Bottom 0.152: X1.20 25.4,10.16 v24.77,10.8
A2
  Top 0.152: X1.21 27.94,11.43 25.63,13.74 IC3.41
A3  (via drill 0.3)
  Top 0.152: v27.31,10.8 25.13,12.97 IC3.40
  Bottom 0.152: v27.31,10.8 27.94,10.16 X1.22
A4
  Top 0.152: X1.23 30.48,11.43 26.63,15.28 IC3.43
A5  (via drill 0.3)
  Top 0.152: v29.85,10.8 26.13,14.51 IC3.42
  Bottom 0.152: X1.24 30.48,10.16 v29.85,10.8
A6
  Top 0.152: X1.25 33.02,11.43 29.63,14.82 IC3.49
A7  (via drill 0.3)
  Top 0.152: v32.39,10.8 28.13,15.05 IC3.46
  Bottom 0.152: X1.26 33.02,10.16 v32.39,10.8
A8
  Top 0.152: X1.27 35.56,17.78 33.44,19.9 IC3.52
A9  (via drill 0.3)
  Top 0.152: v34.93,10.8 30.13,15.59 IC3.50
  Bottom 0.152: X1.28 35.56,10.16 v34.93,10.8
A10
  Top 0.152: X1.29 38.1,17.78 34.98,20.9 IC3.54
A11  (via drill 0.3)
  Top 0.152: v37.47,10.8 37.47,17.15 34.21,20.4 IC3.53
  Bottom 0.152: X1.30 38.1,10.16 v37.47,10.8
A12
  Top 0.152: X1.31 40.64,17.78 36.52,21.9 IC3.56
A13
  Top 0.152: X1.37 48.26,13.97 38.33,23.9 IC3.60
A14  (via drill 0.3)
  Top 0.152: v47.62,10.8 47.62,13.34 37.56,23.4 IC3.59
  Bottom 0.152: X1.38 48.26,10.16 v47.62,10.8
A15
  Top 0.152: X1.39 50.8,13.97 41.91,22.86 41.28,22.86 38.73,25.4 IC3.63
AB0
  Top 0.152: IC3.93 21.63,34.89 4.64,51.88 IC2.45
AB1
  Top 0.152: IC3.80 28.13,34.73 14.64,48.23 IC2.25
AB2
  Top 0.152: IC3.95 20.63,34.62 18.41,36.83 16.51,36.83 14.64,38.7 IC2.24
AB3
  Top 0.152: IC3.96 20.13,34.48 18.41,36.2 16.51,36.2 14.14,38.57 IC2.23
AB4
  Top 0.152: IC3.97 19.63,34.34 18.41,35.56 16.51,35.56 13.64,38.43 IC2.22
AB5
  Top 0.152: IC3.1 14.96,31.4 13.14,33.22 IC2.21
AB6
  Top 0.152: IC2.20 12.64,33.08 14.82,30.9 IC3.2
AB7
  Top 0.152: IC2.19 12.14,32.95 14.69,30.4 IC3.3
AB8
  Top 0.152: IC2.18 11.64,32.81 14.55,29.9 IC3.4
AB9
  Top 0.152: IC2.8 6.64,32.73 13.97,25.4 IC3.13
AB10
  Top 0.152: IC2.7 6.14,32.59 13.84,24.9 IC3.14
AB11
  Top 0.152: IC2.6 5.64,32.46 13.7,24.4 IC3.15
AB12
  Top 0.152: IC2.5 5.14,32.33 13.57,23.9 IC3.16
AB13
  Top 0.152: IC2.4 4.64,32.19 13.43,23.4 IC3.17
AB14
  Top 0.152: IC2.3 4.14,32.05 13.3,22.9 IC3.18
AB15
  Top 0.152: IC2.2 3.64,31.92 13.16,22.4 IC3.19
AB16
  Top 0.152: IC2.1 3.14,31.79 13.03,21.9 IC3.20
AB17
  Top 0.152: IC3.94 21.13,34.75 3.14,52.74 IC2.48
AB18
  Top 0.152: IC2.17 11.14,32.68 14.92,28.9 IC3.6
AB19
  Top 0.152: IC2.16 10.64,32.54 14.78,28.4 IC3.7
AB20
  Top 0.152: IC2.9 7.14,32.87 14.11,25.9 IC3.12
AB21
  Top 0.152: IC2.10 7.64,33 14.24,26.4 IC3.11
AB22
  Top 0.152: IC2.13 9.14,33.41 14.65,27.9 IC3.8
ACC/!WP  (via drill 0.3)
  Top 0.152: IC2.14 9.64,41.39 v11.43,43.18
  Bottom 0.152: v11.43,43.18 11.43,43.16 | v11.43,43.18 R5.1 | WP.2 15.24,46.99 v11.43,43.18
CFG0  (via drill 0.3)
  Top 0.152: IC3.73 35.62,30.4 v37.47,28.56
  Bottom 0.152: v37.47,28.56 37.47,24.89 CFG0.2
CFG1  (via drill 0.3)
  Top 0.152: IC3.72 34.86,29.9 v36.2,28.56
  Bottom 0.152: CFG1.2 36.2,23.62 v36.2,28.56
CFG2  (via drill 0.3)
  Top 0.152: IC3.71 34.09,29.4 v34.93,28.56
  Bottom 0.152: CFG2.2 34.93,22.35 v34.93,28.56
CFG3  (via drill 0.3)
  Top 0.152: IC3.70 33.31,28.9 v33.66,28.56
  Bottom 0.152: v33.66,28.56 CFG3.2
CHANNEL0
  Top 0.152: IC3.77 29.63,39.79 31.12,41.27 31.12,43.82 34.93,47.62 37.47,47.62 37.85,48.01 IC4.11
CHANNEL1  (via drill 0.3)
  Top 0.152: 48.01,48.01 IC5.11 48.01,47.24 v48.26,46.99 | IC3.76 35.3,33.4 v35.56,33.66
  Bottom 0.152: v48.26,46.99 48.26,36.83 47.62,36.2 38.1,36.2 v35.56,33.66
D0  (via drill 0.3)
  Top 0.152: v13.34,10.8 18.63,16.09 IC3.27 18.63,27.09 v18.41,27.3 | IC4.2 32.65,41.54 v32.39,41.27 | IC5.2 42.81,41.54 v42.55,41.27
  Bottom 0.152: X1.10 12.7,10.16 v13.34,10.8 | v18.41,27.3 18.41,31.75 24.13,37.47 28.58,37.47 v32.39,41.27 v42.55,41.27
D1  (via drill 0.3)
  Top 0.152: X1.11 15.24,11.43 19.13,15.32 IC3.28 19.13,27.86 v19.05,27.94 | IC4.3 33.3,40.92 v33.02,40.64 | IC5.3 43.46,40.92 v43.18,40.64
  Bottom 0.152: v19.05,27.94 19.05,31.75 24.13,36.83 29.21,36.83 v33.02,40.64 v43.18,40.64
D2  (via drill 0.3)
  Top 0.152: v15.88,10.8 19.63,14.55 IC3.29 19.63,28.52 v19.69,28.58 | IC4.4 33.95,40.3 v33.66,40.01 | IC5.4 44.11,40.3 v43.81,40.01
  Bottom 0.152: v15.88,10.8 15.24,10.16 X1.12 | v19.69,28.58 19.69,31.75 24.13,36.2 29.85,36.2 v33.66,40.01 v43.81,40.01
D3  (via drill 0.3)
  Top 0.152: X1.13 17.78,11.43 20.13,13.78 IC3.30 20.13,27.75 v20.32,27.94 | IC5.5 44.76,39.68 v44.45,39.37 | IC4.5 34.6,39.68 v34.29,39.37
  Bottom 0.152: v20.32,27.94 20.32,31.75 24.13,35.56 30.48,35.56 v34.29,39.37 v44.45,39.37
D4  (via drill 0.3)
  Top 0.152: v18.41,10.8 21.13,13.51 IC3.32 21.13,19.23 21.59,19.69 v21.59,28.58 | IC5.6 45.41,39.06 v45.09,38.73 | IC4.6 35.25,39.06 v34.93,38.73
  Bottom 0.152: X1.14 17.78,10.16 v18.41,10.8 | v21.59,28.58 21.59,32.39 24.13,34.93 31.12,34.93 v34.93,38.73 v45.09,38.73
D5  (via drill 0.3)
  Top 0.152: X1.15 20.32,11.43 21.63,12.74 IC3.33 21.63,19.09 22.23,19.69 v22.23,27.94 | IC5.7 46.06,38.44 v45.72,38.1 | IC4.7 35.9,38.44 v35.56,38.1
  Bottom 0.152: v22.23,27.94 22.23,32.39 24.13,34.29 31.75,34.29 v35.56,38.1 v45.72,38.1
D6  (via drill 0.3)
  Top 0.152: v20.96,10.8 22.13,11.97 IC3.34 22.13,18.96 22.86,19.69 v22.86,27.3 | IC5.8 46.71,37.82 v46.36,37.47 | IC4.8 36.55,37.82 v36.2,37.47
  Bottom 0.152: X1.16 20.32,10.16 v20.96,10.8 | v22.86,27.3 22.86,32.39 24.13,33.66 32.39,33.66 v36.2,37.47 v46.36,37.47
D7  (via drill 0.3)
  Top 0.152: X1.17 22.86,10.8 22.63,11.03 IC3.35 22.63,18.82 23.5,19.69 v23.5,26.67 | IC5.9 47.36,37.2 v46.99,36.83 | IC4.9 37.2,37.2 v36.83,36.83
  Bottom 0.152: v23.5,26.67 23.5,32.39 24.13,33.02 33.02,33.02 v36.83,36.83 v46.99,36.83
DB0
  Top 0.152: IC3.82 27.13,34.47 12.64,48.95 IC2.29
DB1
  Top 0.152: IC3.85 25.63,35.33 11.64,49.32 IC2.31
DB2
  Top 0.152: IC3.86 25.13,35.2 10.64,49.69 IC2.33
DB3
  Top 0.152: IC3.87 24.63,35.06 9.64,50.05 IC2.35
DB4
  Top 0.152: IC3.89 23.63,35.43 8.14,50.91 IC2.38
DB5
  Top 0.152: IC3.90 23.13,35.29 7.14,51.28 IC2.40
DB6
  Top 0.152: IC3.91 22.63,35.16 6.14,51.65 IC2.42
DB7
  Top 0.152: IC3.92 22.13,35.02 5.14,52.01 IC2.44
E  (via drill 0.3)
  Top 0.152: v8.26,10.8 10.16,12.7 12.7,12.7 13.97,13.97 13.97,19.69 15.19,20.9 IC3.22
  Bottom 0.152: X1.6 7.62,10.16 v8.26,10.8
GND  (via drill 0.3, 0.76)
  Top 1.27: v43.18,10.8 X1.34
  Bottom 1.27: X1.34 v43.18,10.8
  other vias: 17.15,18.42 31.12,32.39 17.15,32.39 27.94,26.67 30.96,18.57 0.64,10.8 0.64,16.51 0.64,21.59 0.64,26.67 0.64,31.75 0.64,36.83 0.64,41.91 0.64,46.99 0.64,52.07 52.7,62.23 0.64,67.94 6.35,67.94 11.43,67.94 16.51,67.94 21.59,66.04 26.67,67.94 31.75,67.94 36.83,67.94 41.91,67.94 46.99,67.94 52.7,67.94 52.7,57.15 52.7,52.07 52.7,46.99 52.7,41.91 52.7,36.83 52.7,31.75 52.7,26.67 52.7,21.59 52.7,16.51 52.7,10.8 3.81,41.27 3.81,57.79 13.97,57.79 13.34,41.27 47.62,43.82 37.47,43.82 44.45,24.77 45.72,34.29 0.64,62.23 0.64,57.15
  pour Top (rank 2): 0,68.58 19.69,68.58 19.69,67.31 24.77,67.31 24.77,68.58 53.34,68.58 53.34,9.52 0,9.52
  pour Bottom (rank 2): 0,68.58 19.69,68.58 19.69,67.31 24.77,67.31 24.77,68.58 53.34,68.58 53.34,9.52 0,9.52
HARD_RESET  (via drill 0.3)
  Top 0.152: IC3.24 17.36,19.9 v17.78,20.32
  Bottom 0.152: R47.1 6.34,46.19 | 6.34,46.19 Q1.3 | 6.34,46.19 7.62,44.9 7.62,43.18 15.24,35.56 15.24,23.5 17.78,20.96 v17.78,20.32
LED  (via drill 0.3)
  Top 0.152: IC3.78 29.13,36.91 v27.94,38.1
  Bottom 0.152: LED1.A 15.24,62.23 15.24,53.34 20.32,48.26 20.32,43.18 25.4,38.1 v27.94,38.1
MISO  (via drill 0.6)
  Top 0.152: IC3.66 40.23,26.9 v40.64,27.3 IC1.2
MOSI  (via drill 0.6)
  Top 0.152: IC1.5 45.72,24.77 45.09,24.13 41.28,24.13 v40.64,24.77 39.51,25.9 IC3.64
N$1
  Bottom 0.152: LED1.K 13.99,67.31 R1.1
N$2
  Top 0.152: IC4.18 33.3,49.25 30.63,51.92 R7.2
N$3  (via drill 0.3)
  Top 0.152: R23.1 v30.48,58.42
  Bottom 0.152: R6.1 R22.2 v30.48,58.42
N$4
  Top 0.152: X2.3 17.23,54.28 C15.-
N$5  (via drill 0.3)
  Top 0.152: IC3.45 27.63,18.74 TDI.TP
  other vias: 27.94,19.05
N$6  (via drill 0.3)
  Top 0.152: IC3.47 28.63,20.9 TMS.TP
  other vias: 27.94,21.59
N$7  (via drill 0.3)
  Top 0.152: IC3.48 29.13,22.94 TCK.TP
  other vias: 27.94,24.13
N$8  (via drill 0.3)
  Top 0.152: IC3.83 26.63,32.43 27.31,31.75 TDO.TP
  other vias: 27.94,31.75
N$10  (via drill 0.3)
  Top 0.152: IC4.19 32.65,49.27 31.75,50.16 v31.12,50.16
  Bottom 0.152: v31.12,50.16 30.48,50.8 R6.2
N$11
  Top 0.152: X2.2 27.23,53.64 C13.-
N$12  (via drill 0.3)
  Top 0.152: IC4.17 33.95,49.87 v33.66,50.16
  Bottom 0.152: v33.66,50.16 33.02,50.8 R8.2
N$13
  Top 0.152: IC4.16 34.6,50.34 R9.2
N$14  (via drill 0.3)
  Top 0.152: IC4.15 35.25,49.86 v35.56,50.16
  Bottom 0.152: v35.56,50.16 R10.2
N$15
  Top 0.152: IC4.14 35.9,49.23 36.2,49.53 36.2,51.28 R11.2
N$16  (via drill 0.3)
  Top 0.152: IC4.13 36.55,49.89 v36.83,50.16
  Bottom 0.152: v36.83,50.16 37.47,50.16 38.1,50.8 R12.2
N$17
  Top 0.152: IC4.12 37.2,49.27 38.1,50.16 R13.2
N$18  (via drill 0.3)
  Top 0.152: R7.1 R23.2 30.48,57.15 v31.75,58.42
  Bottom 0.152: R24.1 33.02,59.69 v31.75,58.42
N$19  (via drill 0.3)
  Top 0.152: R25.1 v33.02,58.42
  Bottom 0.152: R8.1 R24.2 v33.02,58.42
N$20  (via drill 0.3)
  Top 0.152: R9.1 R25.2 33.02,57.15 v34.29,58.42
  Bottom 0.152: v34.29,58.42 35.56,59.69 R26.1
N$21  (via drill 0.3)
  Top 0.152: R27.1 v35.56,58.42
  Bottom 0.152: R10.1 R26.2 v35.56,58.42
N$22  (via drill 0.3)
  Top 0.152: R11.1 R27.2 35.56,57.15 v36.83,58.42
  Bottom 0.152: R28.1 38.1,59.69 v36.83,58.42
N$23  (via drill 0.3)
  Top 0.152: R29.1 v38.1,58.42
  Bottom 0.152: v38.1,58.42 R28.2 R12.1
N$24
  Top 0.152: R13.1 R29.2 39.22,57 39.37,57.15 39.37,60.96 38.73,61.59 34.29,61.59 | 38.1,54.61 R13.1 | R13.1 39.37,53.49 39.37,49.53 C10.1 | C14.1 34.29,61.59 | 34.29,61.59 25.08,61.59 23.18,59.69 23.18,52.77 C13.+
N$31  (via drill 0.3)
  Top 0.152: IC5.19 42.81,49.27 41.91,50.16 v41.28,50.16
  Bottom 0.152: v41.28,50.16 40.64,50.8 R14.2
N$32
  Top 0.152: IC5.18 43.46,49.25 41.28,51.44 41.12,51.44 R15.2
N$33  (via drill 0.3)
  Top 0.152: IC5.17 44.11,49.87 v43.81,50.16
  Bottom 0.152: v43.81,50.16 43.18,50.8 R16.2
N$34
  Top 0.152: IC5.16 44.76,50.34 R17.2
N$35  (via drill 0.3)
  Top 0.152: IC5.15 45.41,49.86 v45.72,50.16
  Bottom 0.152: v45.72,50.16 R18.2
N$36
  Top 0.152: IC5.14 46.06,49.23 46.36,49.53 46.36,51.28 R19.2
N$37  (via drill 0.3)
  Top 0.152: IC5.13 46.71,49.89 v46.99,50.16
  Bottom 0.152: v46.99,50.16 47.62,50.16 48.26,50.8 R20.2
N$38
  Top 0.152: IC5.12 47.36,49.27 48.26,50.16 R21.2
N$39
  Top 0.152: 34.29,65.41 39.37,65.41 43.81,60.96 49.53,60.96 50.17,60.33 50.17,57.79 49.53,57.15 48.41,57.15 R37.2 R21.1 49.38,54.76 50.17,53.98 C11.2 | C16.1 34.29,65.41 | 34.29,65.41 26.73,65.41 21.21,59.88 C15.+
N$40  (via drill 0.3)
  Top 0.152: v48.26,58.42 R37.1
  Bottom 0.152: R20.1 R36.2 v48.26,58.42
N$41  (via drill 0.3)
  Top 0.152: R19.1 R35.2 45.72,57.15 v46.99,58.42
  Bottom 0.152: R36.1 48.26,59.69 v46.99,58.42
N$42  (via drill 0.3)
  Top 0.152: v45.72,58.42 R35.1
  Bottom 0.152: R18.1 R34.2 v45.72,58.42
N$43  (via drill 0.3)
  Top 0.152: R17.1 R33.2 43.18,57.15 v44.45,58.42
  Bottom 0.152: R34.1 45.72,59.69 v44.45,58.42
N$44  (via drill 0.3)
  Top 0.152: v43.18,58.42 R33.1
  Bottom 0.152: R16.1 R32.2 v43.18,58.42
N$45  (via drill 0.3)
  Top 0.152: R15.1 R31.2 40.64,57.15 v41.91,58.42
  Bottom 0.152: R32.1 43.18,59.69 v41.91,58.42
N$46  (via drill 0.3)
  Top 0.152: R31.1 v40.64,58.42
  Bottom 0.152: v40.64,58.42 R30.2 R14.1
N$49
  Top 0.152: C10.2 R38.2
N$50
  Top 0.152: C11.1 R39.2
N$51
  Top 0.152: IC6.2 49.38,32.39 R40.2 50.17,35.56 | R39.1 50.17,35.56 | R38.1 43.33,38.58 46.36,35.56 50.17,35.56
N$52
  Top 0.152: IC6.3 IC6.6 IC6.7
N$54
  Top 0.152: IC6.1 49.38,31.12 R40.1 50.17,24.51 48.13,22.48 C17.+
N$55
  Top 0.152: IC6.5 42.55,34.98 42.53,35 R41.1 R42.2 | 42.47,34.91 IC6.5 | IC6.5 41.28,34.93 40.26,33.91 C12.+
Q
  Top 0.152: X1.7 10.16,11.43 10.8,12.07 12.7,12.07 14.61,13.97 14.61,19.69 15.32,20.4 IC3.23
R/!W  (via drill 0.3)
  Top 0.152: IC3.36 23.13,11.16 v23.5,10.8
  Bottom 0.152: X1.18 22.86,10.16 v23.5,10.8
SCK  (via drill 0.6)
  Top 0.152: IC1.6 45.72,26.04 45.09,25.4 41.28,25.4 v40.64,26.04 40.28,26.4 IC3.65
SND  (via drill 0.3)
  Top 0.152: X1.35 45.72,10.16 v46.36,10.8
  Bottom 0.152: v46.36,10.8 C17.-
SS  (via drill 0.6)
  Top 0.152: IC1.1 v40.64,28.58 39.47,27.4 IC3.67
SS2  (via drill 0.6)
  Top 0.152: IC3.68 38.7,27.9 v40.64,29.85
SW0  (via drill 0.3)
  Top 0.152: IC3.74 34.08,30.9 v35.56,32.39
  Bottom 0.152: v35.56,32.39 38.73,35.56 48.26,35.56 48.9,36.2 48.9,49.53 50.17,50.8 50.17,62.23 R3.1 48.26,64.39 S1.1
SW1
  Top 0.152: S2.2 8.51,60.96 14.61,60.96 15.24,60.33 15.24,48.26 28.63,34.87 IC3.79
  Bottom 0.152: S2.2 5.08,64.39 R4.1

### Text on the board
tNames: SS2 | SS | MISO | SCK | MOSI